# EAGLE design video-cpld (EAGLE 5.11)
DRAWN_BY: Alexios; PROJECT_NAME: CFT Mini-Computer; REVISION: Rev J; SHEET_DESCRIPTION: Bus Connectors; SIMULATION_FILENAME: N/A; URL: http://www.bedroomlan.org/cft

## Sheet 1 of 3
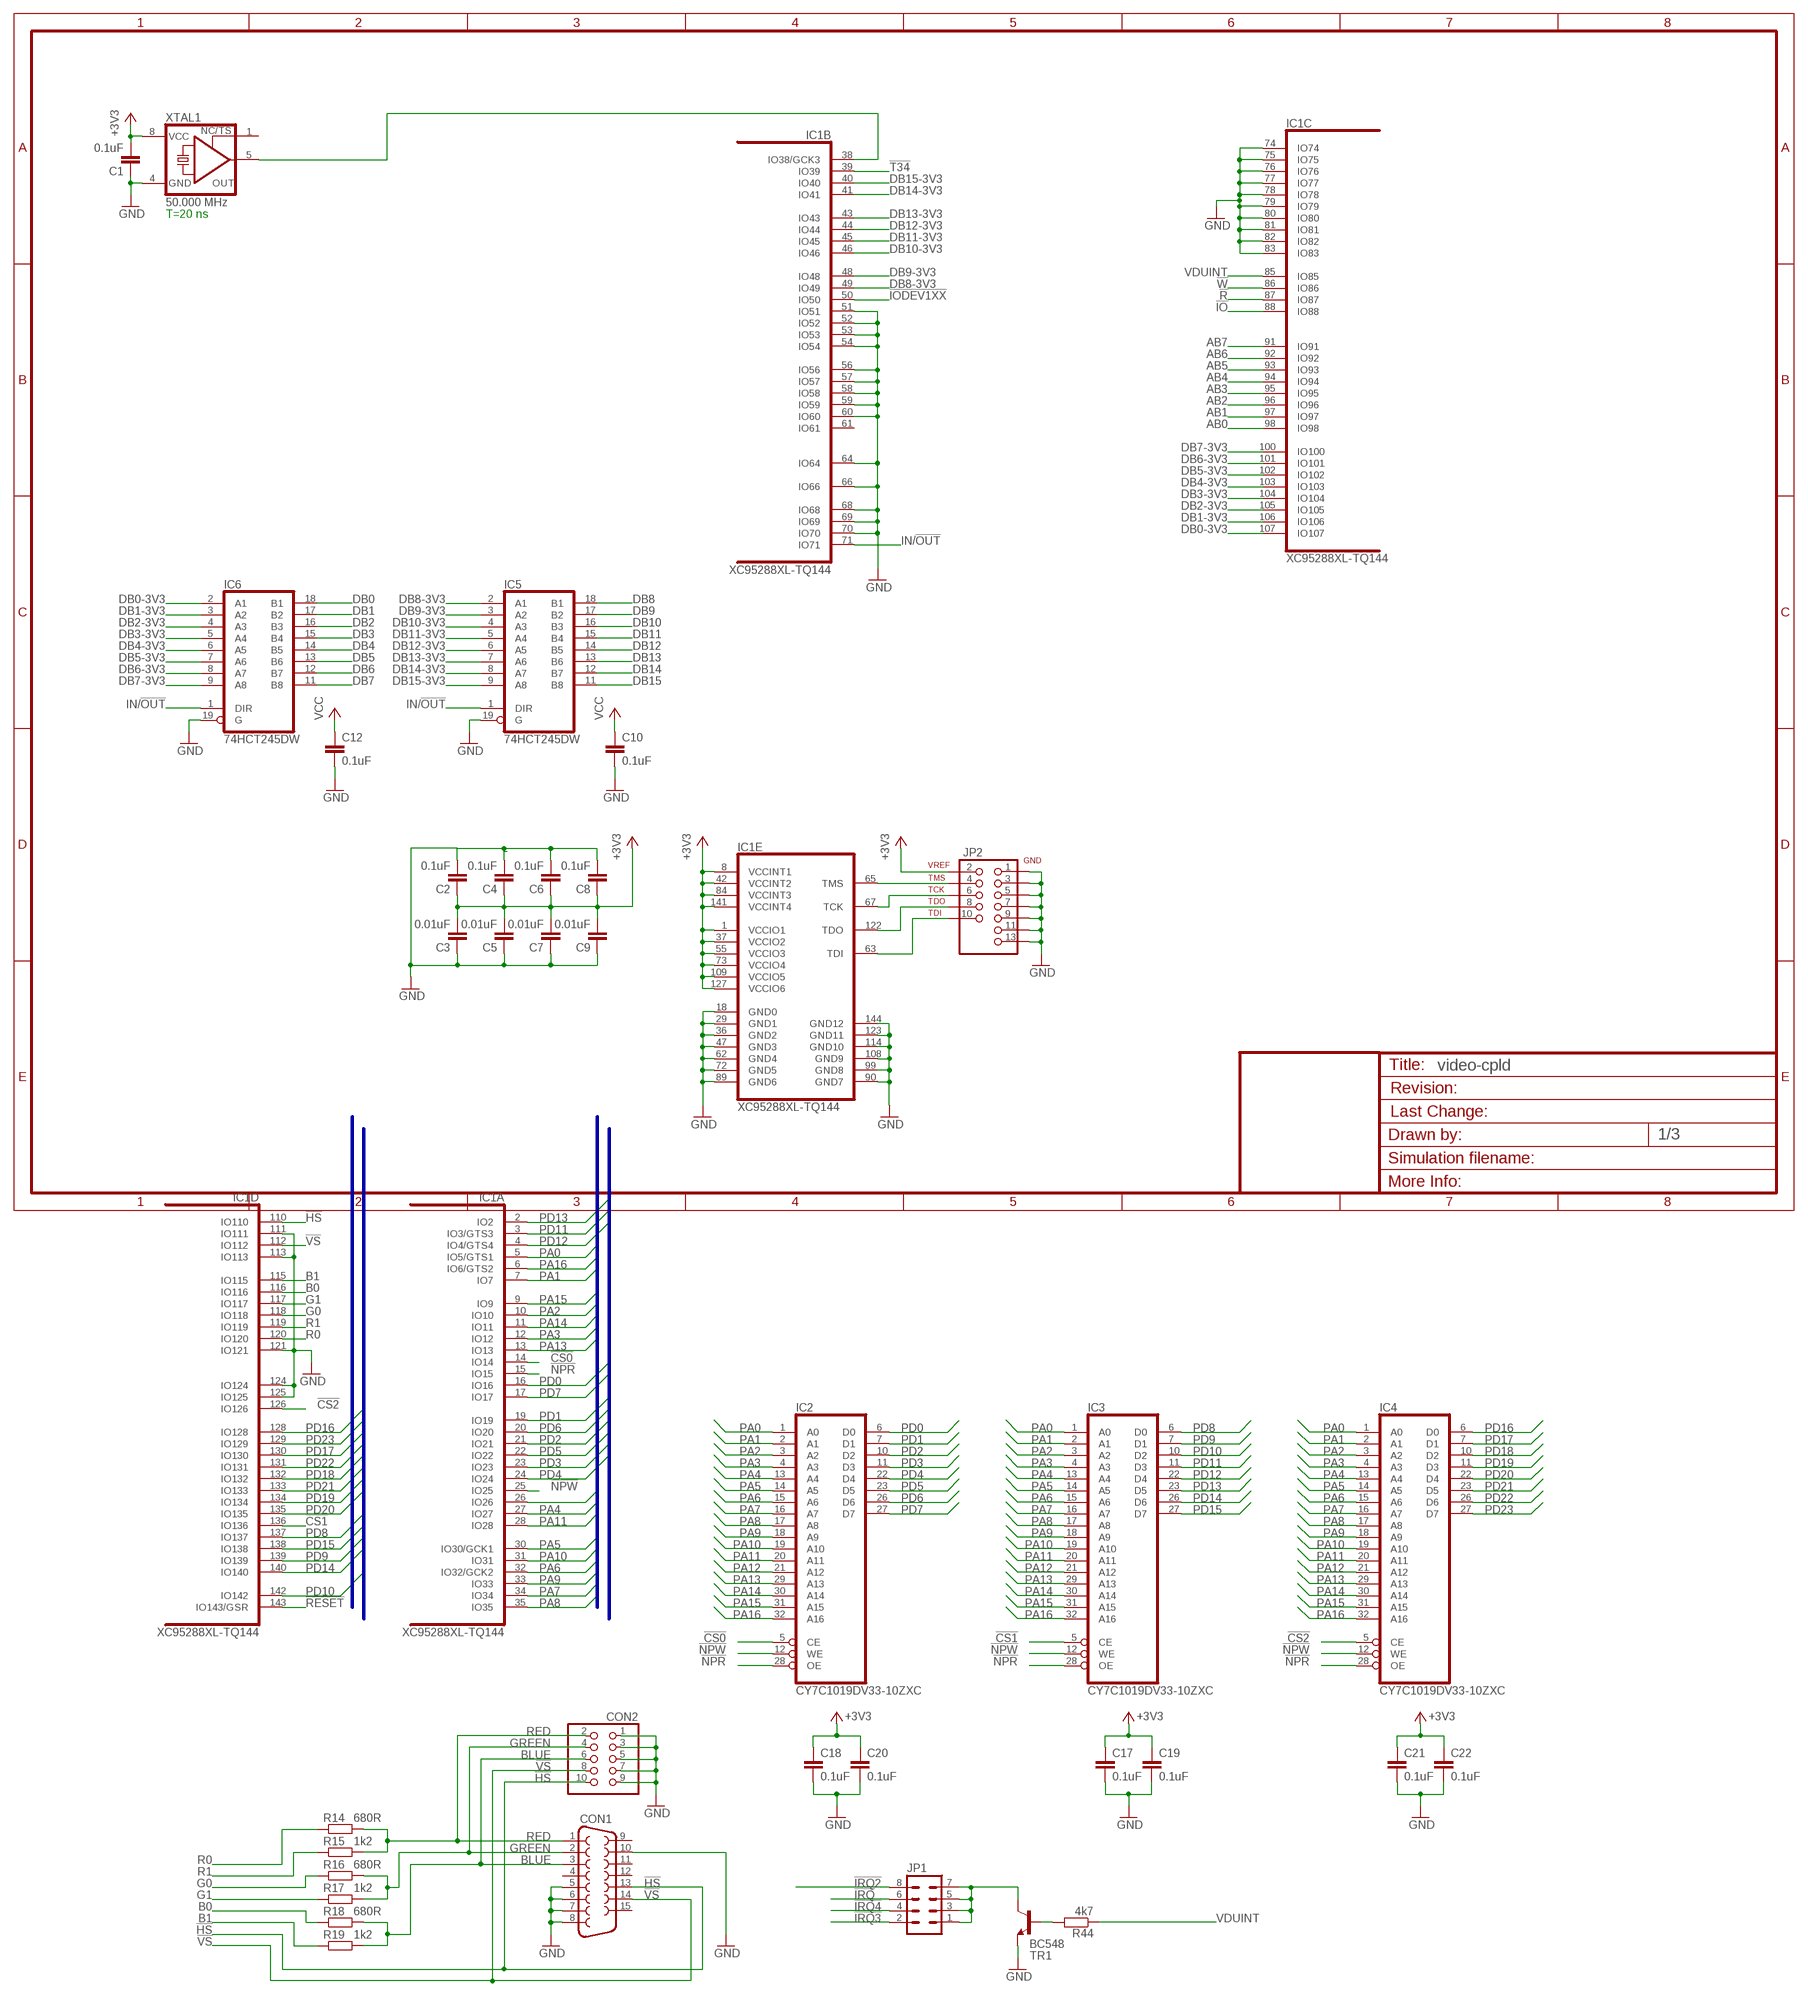
[diagram p0: schematic, sheet 1]

### Parts
C1  0.1uF  C-EUC1206K  [C1206K]
C2  0.1uF  C-EUC1206K  [C1206K]
C3  0.01uF  C-EUC1206K  [C1206K]
C4  0.1uF  C-EUC1206K  [C1206K]
C5  0.01uF  C-EUC1206K  [C1206K]
C6  0.1uF  C-EUC1206K  [C1206K]
C7  0.01uF  C-EUC1206K  [C1206K]
C8  0.1uF  C-EUC1206K  [C1206K]
C9  0.01uF  C-EUC1206K  [C1206K]
C10  0.1uF  C-EUC1206K  [C1206K]
C12  0.1uF  C-EUC1206K  [C1206K]
C17  0.1uF  C-EUC1206K  [C1206K]
C18  0.1uF  C-EUC1206K  [C1206K]
C19  0.1uF  C-EUC1206K  [C1206K]
C20  0.1uF  C-EUC1206K  [C1206K]
C21  0.1uF  C-EUC1206K  [C1206K]
C22  0.1uF  C-EUC1206K  [C1206K]
CON1  F15HDH  [HDF15H]
CON2  PINHD-2X5  [2X05]
IC1  XC95288XL-TQ144  [TQFP144]
IC2  CY7C1019DV33-10ZXC  [TSOPII-32]
IC3  CY7C1019DV33-10ZXC  [TSOPII-32]
IC4  CY7C1019DV33-10ZXC  [TSOPII-32]
IC5  74HCT245DW  [SO20W]
IC6  74HCT245DW  [SO20W]
JP1  MA04-2  [MA04-2]
JP2  JTAG-XILINX-14-2MM  [2X07M]
R14  680R  R-EU_0204/7  [0204/7]
R15  1k2  R-EU_0204/7  [0204/7]
R16  680R  R-EU_0204/7  [0204/7]
R17  1k2  R-EU_0204/7  [0204/7]
R18  680R  R-EU_0204/7  [0204/7]
R19  1k2  R-EU_0204/7  [0204/7]
R44  4k7  R-EU_0204/7  [0204/7]
TR1  BC548  [TO92-EBC]
XTAL1  50.000 MHz  XO-08-SOCKET  [DIL08S-SOCKET]

### Nets
!CS0: IC1.14(A:IO14) IC2.5(CE)
!CS1: IC1.136(D:IO136) IC3.5(CE)
!CS2: IC1.126(D:IO126) IC4.5(CE)
!HS: CON1.13 CON2.10 IC1.110(D:IO110)
!IO: IC1.88(C:IO88) ; also sheet 3
!IODEV1XX: IC1.50(B:IO50) ; also sheet 3
!IRQ: JP1.6 ; also sheet 3
!IRQ2: JP1.8 ; also sheet 3
!IRQ3: JP1.2 ; also sheet 3
!IRQ4: JP1.4 ; also sheet 3
!NPR: IC1.15(A:IO15) IC2.28(OE) IC3.28(OE) IC4.28(OE)
!NPW: IC1.25(A:IO25) IC2.12(WE) IC3.12(WE) IC4.12(WE)
!R: IC1.87(C:IO87) ; also sheet 3
!RESET: IC1.143(D:IO143/GSR) ; also sheet 3
!T34: IC1.39(B:IO39) ; also sheet 3
!VS: CON1.14 CON2.8 IC1.112(D:IO112)
!W: IC1.86(C:IO86) ; also sheet 3
+3V3 [3.3V power]: C1.2 C2.1 C3.2 C4.1 C5.2 C6.1 C7.2 C8.1 C9.2 C17.1 C18.1 C19.1 C20.1 C21.1 C22.1 IC1.1(E:VCCIO1) IC1.8(E:VCCINT1) IC1.37(E:VCCIO2) IC1.42(E:VCCINT2) IC1.55(E:VCCIO3) IC1.73(E:VCCIO4) IC1.84(E:VCCINT3) IC1.109(E:VCCIO5) IC1.127(E:VCCIO6) IC1.141(E:VCCINT4) JP2.2(VREF) XTAL1.8(VCC) ; also sheet 3
AB0: IC1.98(C:IO98) ; also sheet 3
AB1: IC1.97(C:IO97) ; also sheet 3
AB2: IC1.96(C:IO96) ; also sheet 3
AB3: IC1.95(C:IO95) ; also sheet 3
AB4: IC1.94(C:IO94) ; also sheet 3
AB5: IC1.93(C:IO93) ; also sheet 3
AB6: IC1.92(C:IO92) ; also sheet 3
AB7: IC1.91(C:IO91) ; also sheet 3
B0: IC1.116(D:IO116) R18.1
B1: IC1.115(D:IO115) R19.1
BLUE [Analogue]: CON1.3 CON2.6 R18.2 R19.2
DB0: IC6.18(B1) ; also sheet 3
DB0-3V3: IC1.107(C:IO107) IC6.2(A1)
DB1: IC6.17(B2) ; also sheet 3
DB1-3V3: IC1.106(C:IO106) IC6.3(A2)
DB2: IC6.16(B3) ; also sheet 3
DB2-3V3: IC1.105(C:IO105) IC6.4(A3)
DB3: IC6.15(B4) ; also sheet 3
DB3-3V3: IC1.104(C:IO104) IC6.5(A4)
DB4: IC6.14(B5) ; also sheet 3
DB4-3V3: IC1.103(C:IO103) IC6.6(A5)
DB5: IC6.13(B6) ; also sheet 3
DB5-3V3: IC1.102(C:IO102) IC6.7(A6)
DB6: IC6.12(B7) ; also sheet 3
DB6-3V3: IC1.101(C:IO101) IC6.8(A7)
DB7: IC6.11(B8) ; also sheet 3
DB7-3V3: IC1.100(C:IO100) IC6.9(A8)
DB8: IC5.18(B1) ; also sheet 3
DB8-3V3: IC1.49(B:IO49) IC5.2(A1)
DB9: IC5.17(B2) ; also sheet 3
DB9-3V3: IC1.48(B:IO48) IC5.3(A2)
DB10: IC5.16(B3) ; also sheet 3
DB10-3V3: IC1.46(B:IO46) IC5.4(A3)
DB11: IC5.15(B4) ; also sheet 3
DB11-3V3: IC1.45(B:IO45) IC5.5(A4)
DB12: IC5.14(B5) ; also sheet 3
DB12-3V3: IC1.44(B:IO44) IC5.6(A5)
DB13: IC5.13(B6) ; also sheet 3
DB13-3V3: IC1.43(B:IO43) IC5.7(A6)
DB14: IC5.12(B7) ; also sheet 3
DB14-3V3: IC1.41(B:IO41) IC5.8(A7)
DB15: IC5.11(B8) ; also sheet 3
DB15-3V3: IC1.40(B:IO40) IC5.9(A8)
G0: IC1.118(D:IO118) R16.1
G1: IC1.117(D:IO117) R17.1
GND [3.3V power]: C1.1 C2.2 C3.1 C4.2 C5.1 C6.2 C7.1 C8.2 C9.1 C10.2 C12.2 C17.2 C18.2 C19.2 C20.2 C21.2 C22.2 CON1.5 CON1.6 CON1.7 CON1.8 CON1.10 CON2.1 CON2.3 CON2.5 CON2.7 CON2.9 IC1.18(E:GND0) IC1.29(E:GND1) IC1.36(E:GND2) IC1.47(E:GND3) IC1.51(B:IO51) IC1.52(B:IO52) IC1.53(B:IO53) IC1.54(B:IO54) IC1.56(B:IO56) IC1.57(B:IO57) IC1.58(B:IO58) IC1.59(B:IO59) IC1.60(B:IO60) IC1.62(E:GND4) IC1.64(B:IO64) IC1.66(B:IO66) IC1.68(B:IO68) IC1.69(B:IO69) IC1.70(B:IO70) IC1.72(E:GND5) IC1.74(C:IO74) IC1.75(C:IO75) IC1.76(C:IO76) IC1.77(C:IO77) IC1.78(C:IO78) IC1.79(C:IO79) IC1.80(C:IO80) IC1.81(C:IO81) IC1.82(C:IO82) IC1.83(C:IO83) IC1.89(E:GND6) IC1.90(E:GND7) IC1.99(E:GND8) IC1.108(E:GND9) IC1.111(D:IO111) IC1.113(D:IO113) IC1.114(E:GND10) IC1.121(D:IO121) IC1.123(E:GND11) IC1.124(D:IO124) IC1.125(D:IO125) IC1.144(E:GND12) IC5.19(G) IC6.19(G) JP2.1(VGND) JP2.3(GND2) JP2.5(GND3) JP2.7(GND4) JP2.9(GND5) JP2.11(GND6) JP2.13(GND7) TR1.E XTAL1.4(GND) ; also sheet 3
GREEN [Analogue]: CON1.2 CON2.4 R16.2 R17.2
IN/!OUT: IC1.71(B:IO71) IC5.1(DIR) IC6.1(DIR)
N$1: IC1.38(B:IO38/GCK3) XTAL1.5(OUT)
N$260: JP1.1 JP1.3 JP1.5 JP1.7 TR1.C
N$843: R44.2 TR1.B
PA0: IC1.5(A:IO5/GTS1) IC2.1(A0) IC3.1(A0) IC4.1(A0) ; also sheet 2
PA1: IC1.7(A:IO7) IC2.2(A1) IC3.2(A1) IC4.2(A1) ; also sheet 2
PA2: IC1.10(A:IO10) IC2.3(A2) IC3.3(A2) IC4.3(A2) ; also sheet 2
PA3: IC1.12(A:IO12) IC2.4(A3) IC3.4(A3) IC4.4(A3) ; also sheet 2
PA4: IC1.27(A:IO27) IC2.13(A4) IC3.13(A4) IC4.13(A4) ; also sheet 2
PA5: IC1.30(A:IO30/GCK1) IC2.14(A5) IC3.14(A5) IC4.14(A5) ; also sheet 2
PA6: IC1.32(A:IO32/GCK2) IC2.15(A6) IC3.15(A6) IC4.15(A6) ; also sheet 2
PA7: IC1.34(A:IO34) IC2.16(A7) IC3.16(A7) IC4.16(A7) ; also sheet 2
PA8: IC1.35(A:IO35) IC2.17(A8) IC3.17(A8) IC4.17(A8) ; also sheet 2
PA9: IC1.33(A:IO33) IC2.18(A9) IC3.18(A9) IC4.18(A9) ; also sheet 2
PA10: IC1.31(A:IO31) IC2.19(A10) IC3.19(A10) IC4.19(A10) ; also sheet 2
PA11: IC1.28(A:IO28) IC2.20(A11) IC3.20(A11) IC4.20(A11) ; also sheet 2
PA12: IC1.26(A:IO26) IC2.21(A12) IC3.21(A12) IC4.21(A12) ; also sheet 2
PA13: IC1.13(A:IO13) IC2.29(A13) IC3.29(A13) IC4.29(A13) ; also sheet 2
PA14: IC1.11(A:IO11) IC2.30(A14) IC3.30(A14) IC4.30(A14) ; also sheet 2
PA15: IC1.9(A:IO9) IC2.31(A15) IC3.31(A15) IC4.31(A15)
PA16: IC1.6(A:IO6/GTS2) IC2.32(A16) IC3.32(A16) IC4.32(A16)
PD0: IC1.16(A:IO16) IC2.6(D0) ; also sheet 2
PD1: IC1.19(A:IO19) IC2.7(D1) ; also sheet 2
PD2: IC1.21(A:IO21) IC2.10(D2) ; also sheet 2
PD3: IC1.23(A:IO23) IC2.11(D3) ; also sheet 2
PD4: IC1.24(A:IO24) IC2.22(D4) ; also sheet 2
PD5: IC1.22(A:IO22) IC2.23(D5) ; also sheet 2
PD6: IC1.20(A:IO20) IC2.26(D6) ; also sheet 2
PD7: IC1.17(A:IO17) IC2.27(D7) ; also sheet 2
PD8: IC1.137(D:IO137) IC3.6(D0) ; also sheet 2
PD9: IC1.139(D:IO139) IC3.7(D1) ; also sheet 2
PD10: IC1.142(D:IO142) IC3.10(D2) ; also sheet 2
PD11: IC1.3(A:IO3/GTS3) IC3.11(D3) ; also sheet 2
PD12: IC1.4(A:IO4/GTS4) IC3.22(D4) ; also sheet 2
PD13: IC1.2(A:IO2) IC3.23(D5) ; also sheet 2
PD14: IC1.140(D:IO140) IC3.26(D6) ; also sheet 2
PD15: IC1.138(D:IO138) IC3.27(D7) ; also sheet 2
PD16: IC1.128(D:IO128) IC4.6(D0) ; also sheet 2
PD17: IC1.130(D:IO130) IC4.7(D1) ; also sheet 2
PD18: IC1.132(D:IO132) IC4.10(D2) ; also sheet 2
PD19: IC1.134(D:IO134) IC4.11(D3) ; also sheet 2
PD20: IC1.135(D:IO135) IC4.22(D4) ; also sheet 2
PD21: IC1.133(D:IO133) IC4.23(D5) ; also sheet 2
PD22: IC1.131(D:IO131) IC4.26(D6) ; also sheet 2
PD23: IC1.129(D:IO129) IC4.27(D7) ; also sheet 2
R0: IC1.120(D:IO120) R14.1
R1: IC1.119(D:IO119) R15.1
RED [Analogue]: CON1.1 CON2.2 R14.2 R15.2
TCK: IC1.67(E:TCK) JP2.6(TCK)
TDI: IC1.63(E:TDI) JP2.10(TDI)
TDO: IC1.122(E:TDO) JP2.8(TDO)
TMS: IC1.65(E:TMS) JP2.4(TMS)
VCC: C10.1 C12.1 ; also sheet 3
VDUINT: IC1.85(C:IO85) R44.1
Unconnected: CON1.4 CON1.9 CON1.11 CON1.12 CON1.15 IC1.61(B:IO61) XTAL1.1(TS)

### Buses
PA[0..16]
PD[0..23]

### Notes on the sheet
- T=20 ns

## Sheet 2 of 3
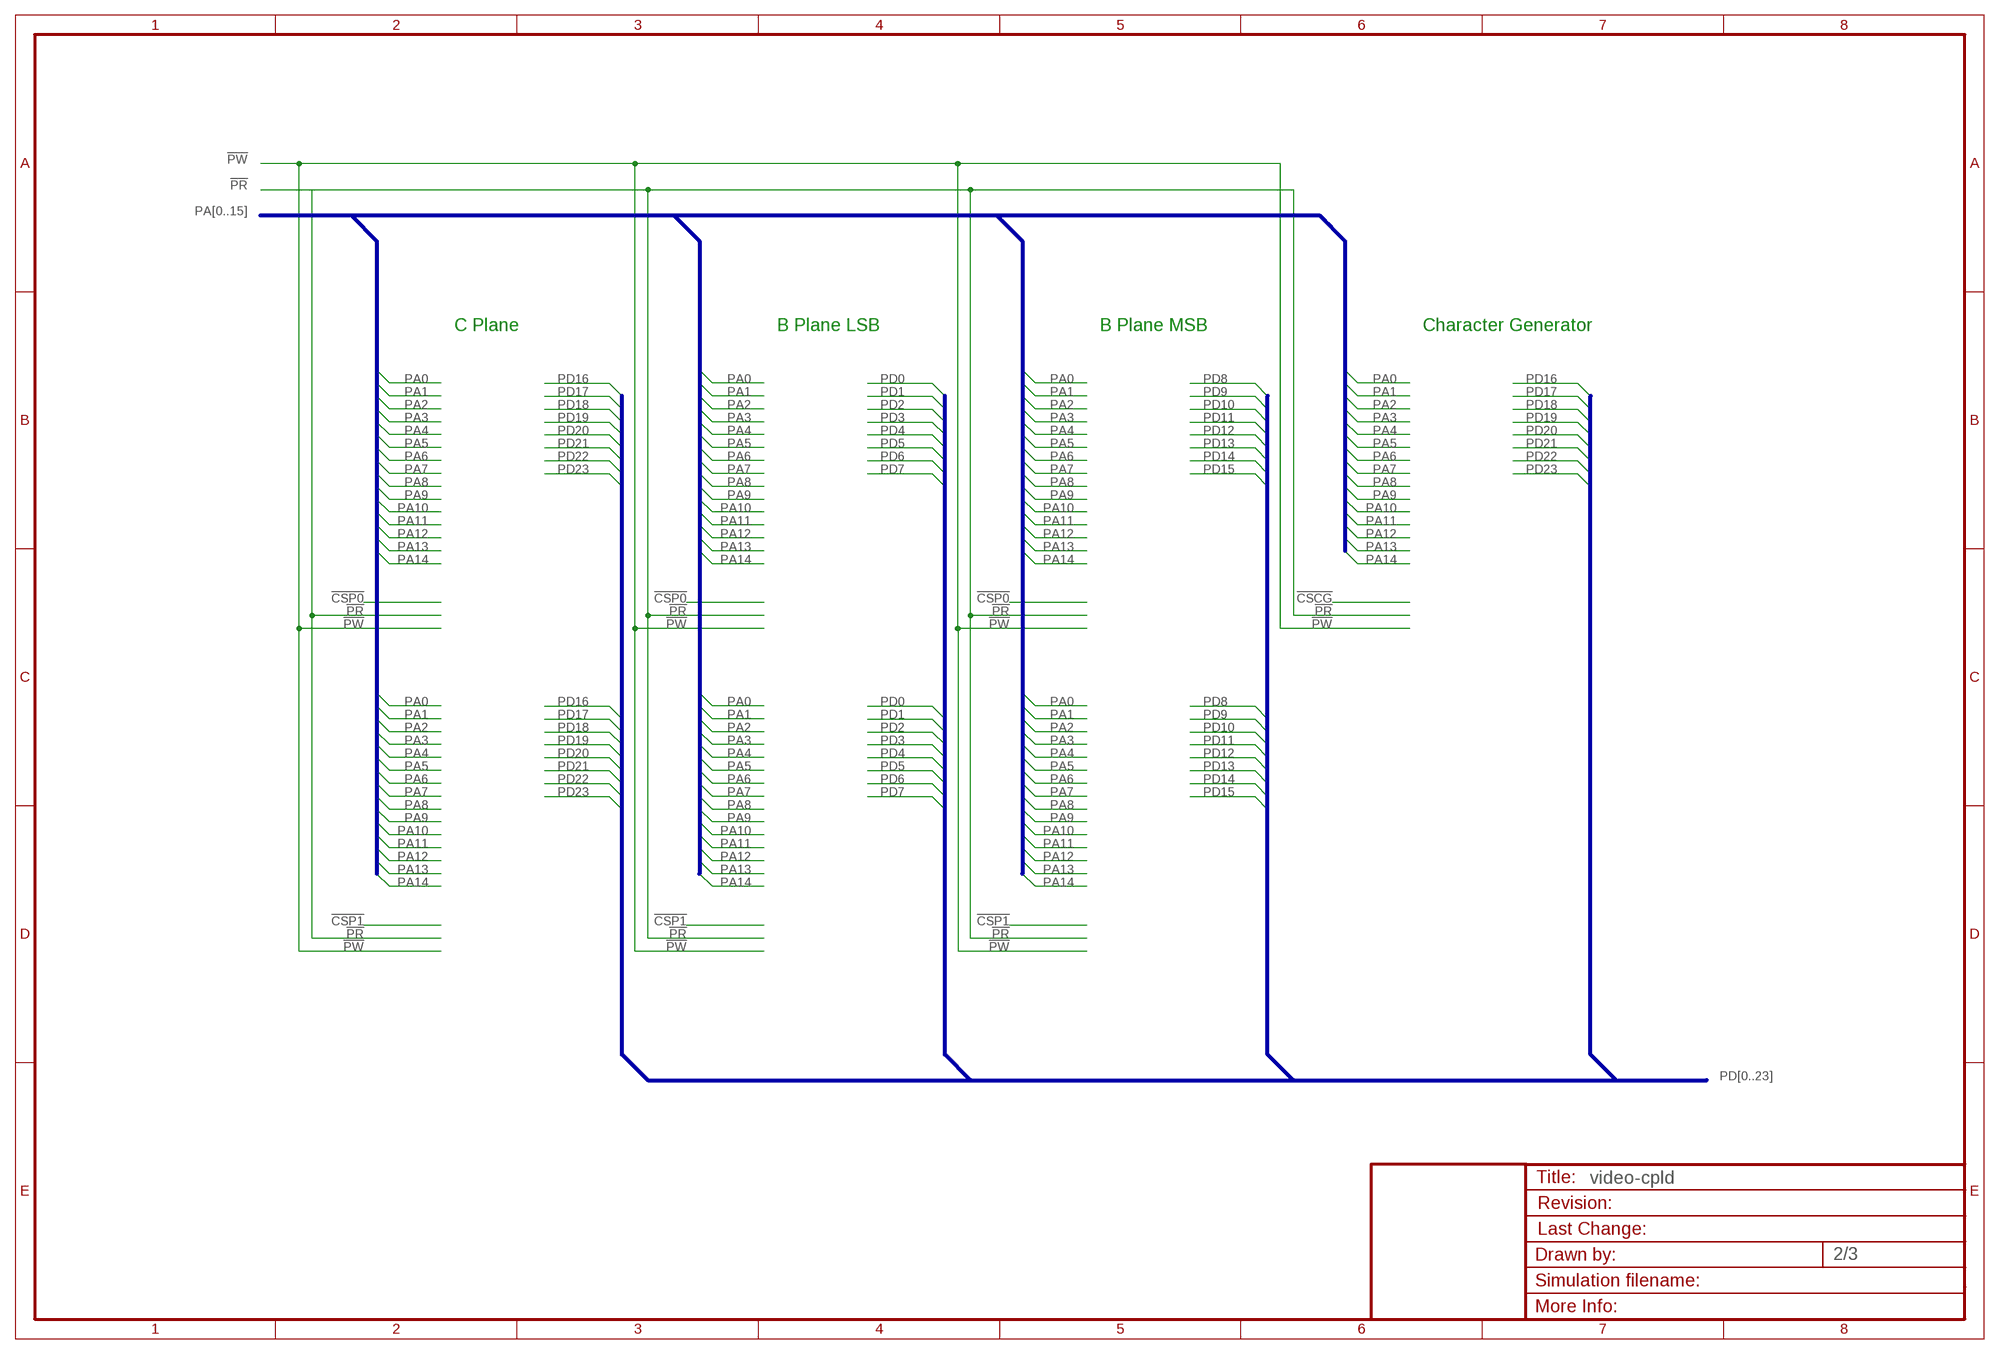
[diagram p1: schematic, sheet 2]

### Buses
PA[0..15]
CD[0..15]
PD[0..15]
PD[0..23]
CD[0..23]

### Notes on the sheet
- C Plane | B Plane LSB | B Plane MSB | Character Generator

## Sheet 3 of 3
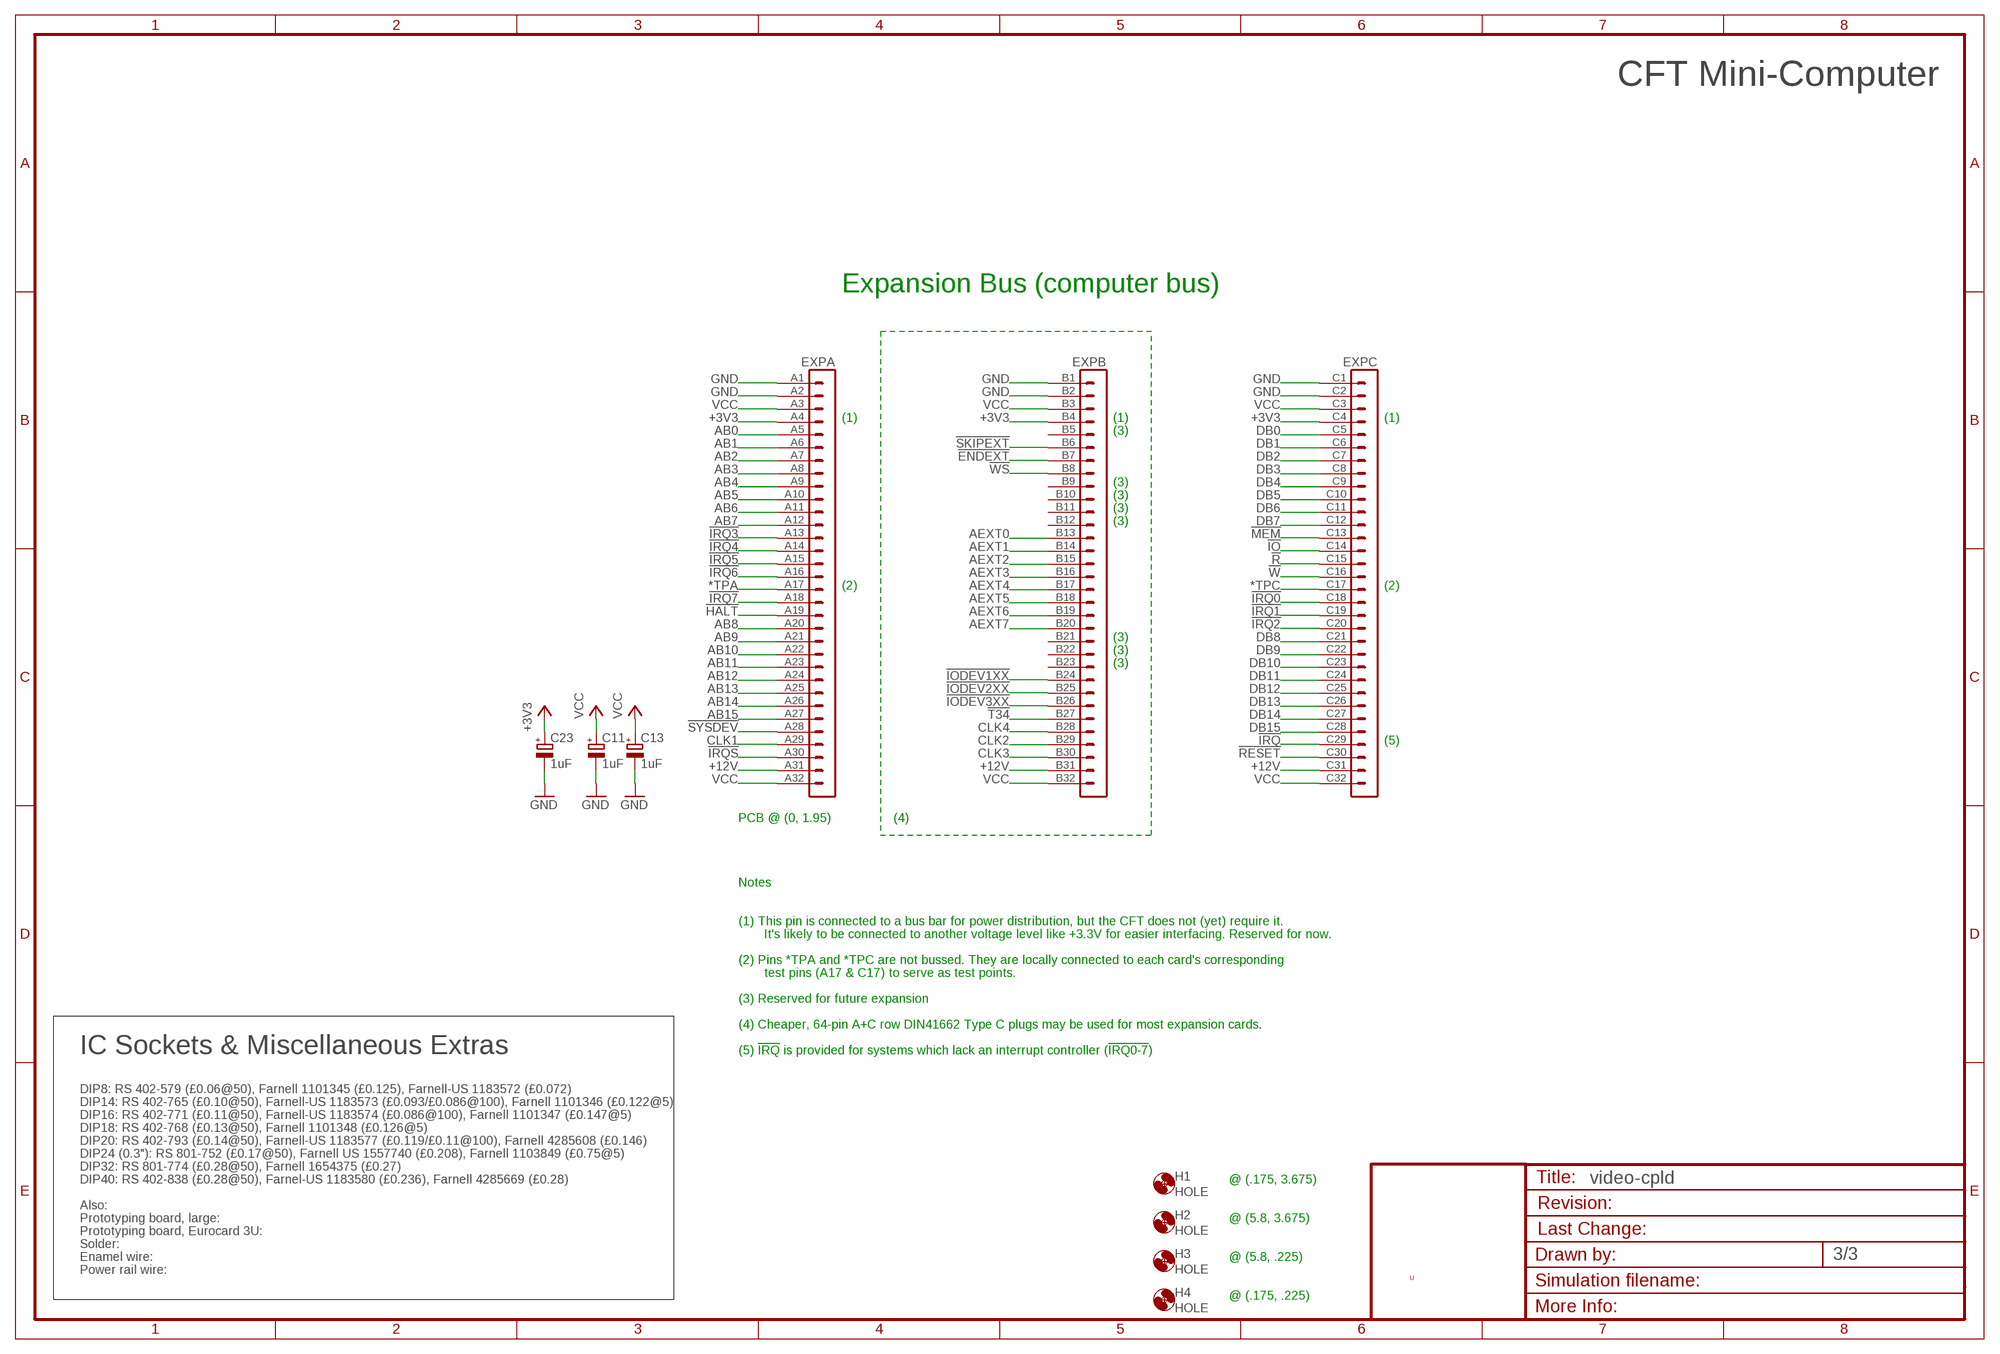
[diagram p2: schematic, sheet 3]

### Parts
C11  1uF  CPOL-EUE2.5-5  [E2,5-5]
C13  1uF  CPOL-EUE2.5-5  [E2,5-5]
C23  1uF  CPOL-EUE2.5-5  [E2,5-5]
EXP  VG96-3K  [VG96K]
H1  HOLE  [STANDOFF_28_60]
H2  HOLE  [STANDOFF_28_60]
H3  HOLE  [STANDOFF_28_60]
H4  HOLE  [STANDOFF_28_60]

### Nets
!ENDEXT: EXP.B7
!HALT: EXP.A19
!IO: EXP.C14 ; also sheet 1
!IODEV1XX: EXP.B24 ; also sheet 1
!IODEV2XX: EXP.B25
!IODEV3XX: EXP.B26
!IRQ: EXP.C29 ; also sheet 1
!IRQ0: EXP.C18
!IRQ1: EXP.C19
!IRQ2: EXP.C20 ; also sheet 1
!IRQ3: EXP.A13 ; also sheet 1
!IRQ4: EXP.A14 ; also sheet 1
!IRQ5: EXP.A15
!IRQ6: EXP.A16
!IRQ7: EXP.A18
!IRQS: EXP.A30
!MEM: EXP.C13
!R: EXP.C15 ; also sheet 1
!RESET: EXP.C30 ; also sheet 1
!SKIPEXT: EXP.B6
!SYSDEV: EXP.A28
!T34: EXP.B27 ; also sheet 1
!W: EXP.C16 ; also sheet 1
!WS: EXP.B8
*TPA: EXP.A17
*TPC: EXP.C17
+3V3 [3.3V power]: C23.+ EXP.A4 EXP.B4 EXP.C4 ; also sheet 1
+12V [LED power]: EXP.A31 EXP.B31 EXP.C31
AB0: EXP.A5 ; also sheet 1
AB1: EXP.A6 ; also sheet 1
AB2: EXP.A7 ; also sheet 1
AB3: EXP.A8 ; also sheet 1
AB4: EXP.A9 ; also sheet 1
AB5: EXP.A10 ; also sheet 1
AB6: EXP.A11 ; also sheet 1
AB7: EXP.A12 ; also sheet 1
AB8: EXP.A20
AB9: EXP.A21
AB10: EXP.A22
AB11: EXP.A23
AB12: EXP.A24
AB13: EXP.A25
AB14: EXP.A26
AB15: EXP.A27
AEXT0: EXP.B13
AEXT1: EXP.B14
AEXT2: EXP.B15
AEXT3: EXP.B16
AEXT4: EXP.B17
AEXT5: EXP.B18
AEXT6: EXP.B19
AEXT7: EXP.B20
CLK1: EXP.A29
CLK2: EXP.B29
CLK3: EXP.B30
CLK4: EXP.B28
DB0: EXP.C5 ; also sheet 1
DB1: EXP.C6 ; also sheet 1
DB2: EXP.C7 ; also sheet 1
DB3: EXP.C8 ; also sheet 1
DB4: EXP.C9 ; also sheet 1
DB5: EXP.C10 ; also sheet 1
DB6: EXP.C11 ; also sheet 1
DB7: EXP.C12 ; also sheet 1
DB8: EXP.C21 ; also sheet 1
DB9: EXP.C22 ; also sheet 1
DB10: EXP.C23 ; also sheet 1
DB11: EXP.C24 ; also sheet 1
DB12: EXP.C25 ; also sheet 1
DB13: EXP.C26 ; also sheet 1
DB14: EXP.C27 ; also sheet 1
DB15: EXP.C28 ; also sheet 1
GND [3.3V power]: C11.- C13.- C23.- EXP.A1 EXP.A2 EXP.B1 EXP.B2 EXP.C1 EXP.C2 ; also sheet 1
VCC: C11.+ C13.+ EXP.A3 EXP.A32 EXP.B3 EXP.B32 EXP.C3 EXP.C32 ; also sheet 1
Unconnected: EXP.B5 EXP.B9 EXP.B10 EXP.B11 EXP.B12 EXP.B21 EXP.B22 EXP.B23

### Notes on the sheet
- CFT Mini-Computer
- Expansion Bus (computer bus)
- (1) | (1) | (1)
- (3)
- (3)
- (3)
- (3)
- (3)
- (2) | (2)
- (3)
- (3)
- (3)
- (5)
- PCB @ (0, 1.95) | (4)
- Notes
- (1) This pin is connected to a bus bar for power distribution, but the CFT does not (yet) require it.
- It's likely to be connected to another voltage level like +3.3V for easier interfacing. Reserved for now.
- (2) Pins *TPA and *TPC are not bussed. They are locally connected to each card's corresponding
- test pins (A17 & C17) to serve as test points.
- (3) Reserved for future expansion
- (4) Cheaper, 64-pin A+C row DIN41662 Type C plugs may be used for most expansion cards.
- IC Sockets & Miscellaneous Extras | (5) !IRQ! is provided for systems which lack an interrupt controller (!IRQ0-7!)
- DIP8: RS 402-579 (£0.06@50), Farnell 1101345 (£0.125), Farnell-US 1183572 (£0.072)
- DIP14: RS 402-765 (£0.10@50), Farnell-US 1183573 (£0.093/£0.086@100), Farnell 1101346 (£0.122@5)
- DIP16: RS 402-771 (£0.11@50), Farnell-US 1183574 (£0.086@100), Farnell 1101347 (£0.147@5)
- DIP18: RS 402-768 (£0.13@50), Farnell 1101348 (£0.126@5)
- DIP20: RS 402-793 (£0.14@50), Farnell-US 1183577 (£0.119/£0.11@100), Farnell 4285608 (£0.146)
- DIP24 (0.3"): RS 801-752 (£0.17@50), Farnell US 1557740 (£0.208), Farnell 1103849 (£0.75@5)
- DIP32: RS 801-774 (£0.28@50), Farnell 1654375 (£0.27)
- DIP40: RS 402-838 (£0.28@50), Farnel-US 1183580 (£0.236), Farnell 4285669 (£0.28) | @ (.175, 3.675)
- Also:
- Prototyping board, large: | @ (5.8, 3.675)
- Prototyping board, Eurocard 3U:
- Solder:
- Enamel wire: | @ (5.8, .225)
- Power rail wire:
- U
- @ (.175, .225)

## Power pins joined to a net without a drawn wire
+3V3: IC2.8(+3V3) IC2.24(+3V3) IC3.8(+3V3) IC3.24(+3V3) IC4.8(+3V3) IC4.24(+3V3)
GND: IC2.9(GND) IC2.25(GND) IC3.9(GND) IC3.25(GND) IC4.9(GND) IC4.25(GND) IC5.10(GND) IC6.10(GND)
VCC: IC5.20(VCC) IC6.20(VCC)

## Library data of the parts
C1-C10 C12 C17-C22 = rcl:C-EU: CAPACITOR, European symbol
C11 C13 C23 = rcl:CPOL-EU: POLARIZED CAPACITOR, European symbol
CON1 = con-subd:F15: SUB-D; OC_FARNELL: unknown; OC_NEWARK: unknown
CON2 = pinhead:PINHD-2X5: PIN HEADER
EXP = alexios-19inch:VG96-3: PCB EUROCARD, 96-pin type C/ABC, 2.54 mm
H1-H4 = alexios:HOLE: Hole for a standoff or mount. Hole diameter: 3.3mm. External Diameter: 6mm.
IC1 = alexios:XC95288XL: Xilinx 288 Macrocell, 144-pin CPLD
IC2-IC4 = alexios:CY7C1019DV33: 128K x 8 Static RAM 10ns Source: Cypress CYP05780611.pdf
IC5 IC6 = alexios:74*245: Octal BUS TRANSCEIVER, 3-state
JP1 = con-lstb:MA04-2: PIN HEADER; OC_FARNELL: unknown; OC_NEWARK: unknown
JP2 = alexios:JTAG: Xilinx JTAG implemented as a 2×14-pin 2mm pitch through-hole header.
R14-R19 R44 = rcl:R-EU_: RESISTOR, European symbol
TR1 = transistor-npn:BC548*: NPN Transistor
XTAL1 = alexios:XO-: Crystal Oscillator for DIP sockets Crystal oscillators in DIP8 or DIP14 packages with sockets. Drills extra holes on the PCB to allow a standard DIP8 or DIP14 socket to be installed.

## Net classes
0 default: width 0.254 mm, clearance 0.203 mm
1 low power: width 1.27 mm, clearance 0.254 mm
2 LED power: width 1.93 mm, clearance 0.254 mm
3 3.3V power: width 0.61 mm, clearance 0.203 mm
4 Analogue: width 0.406 mm, clearance 0.305 mm

## Board
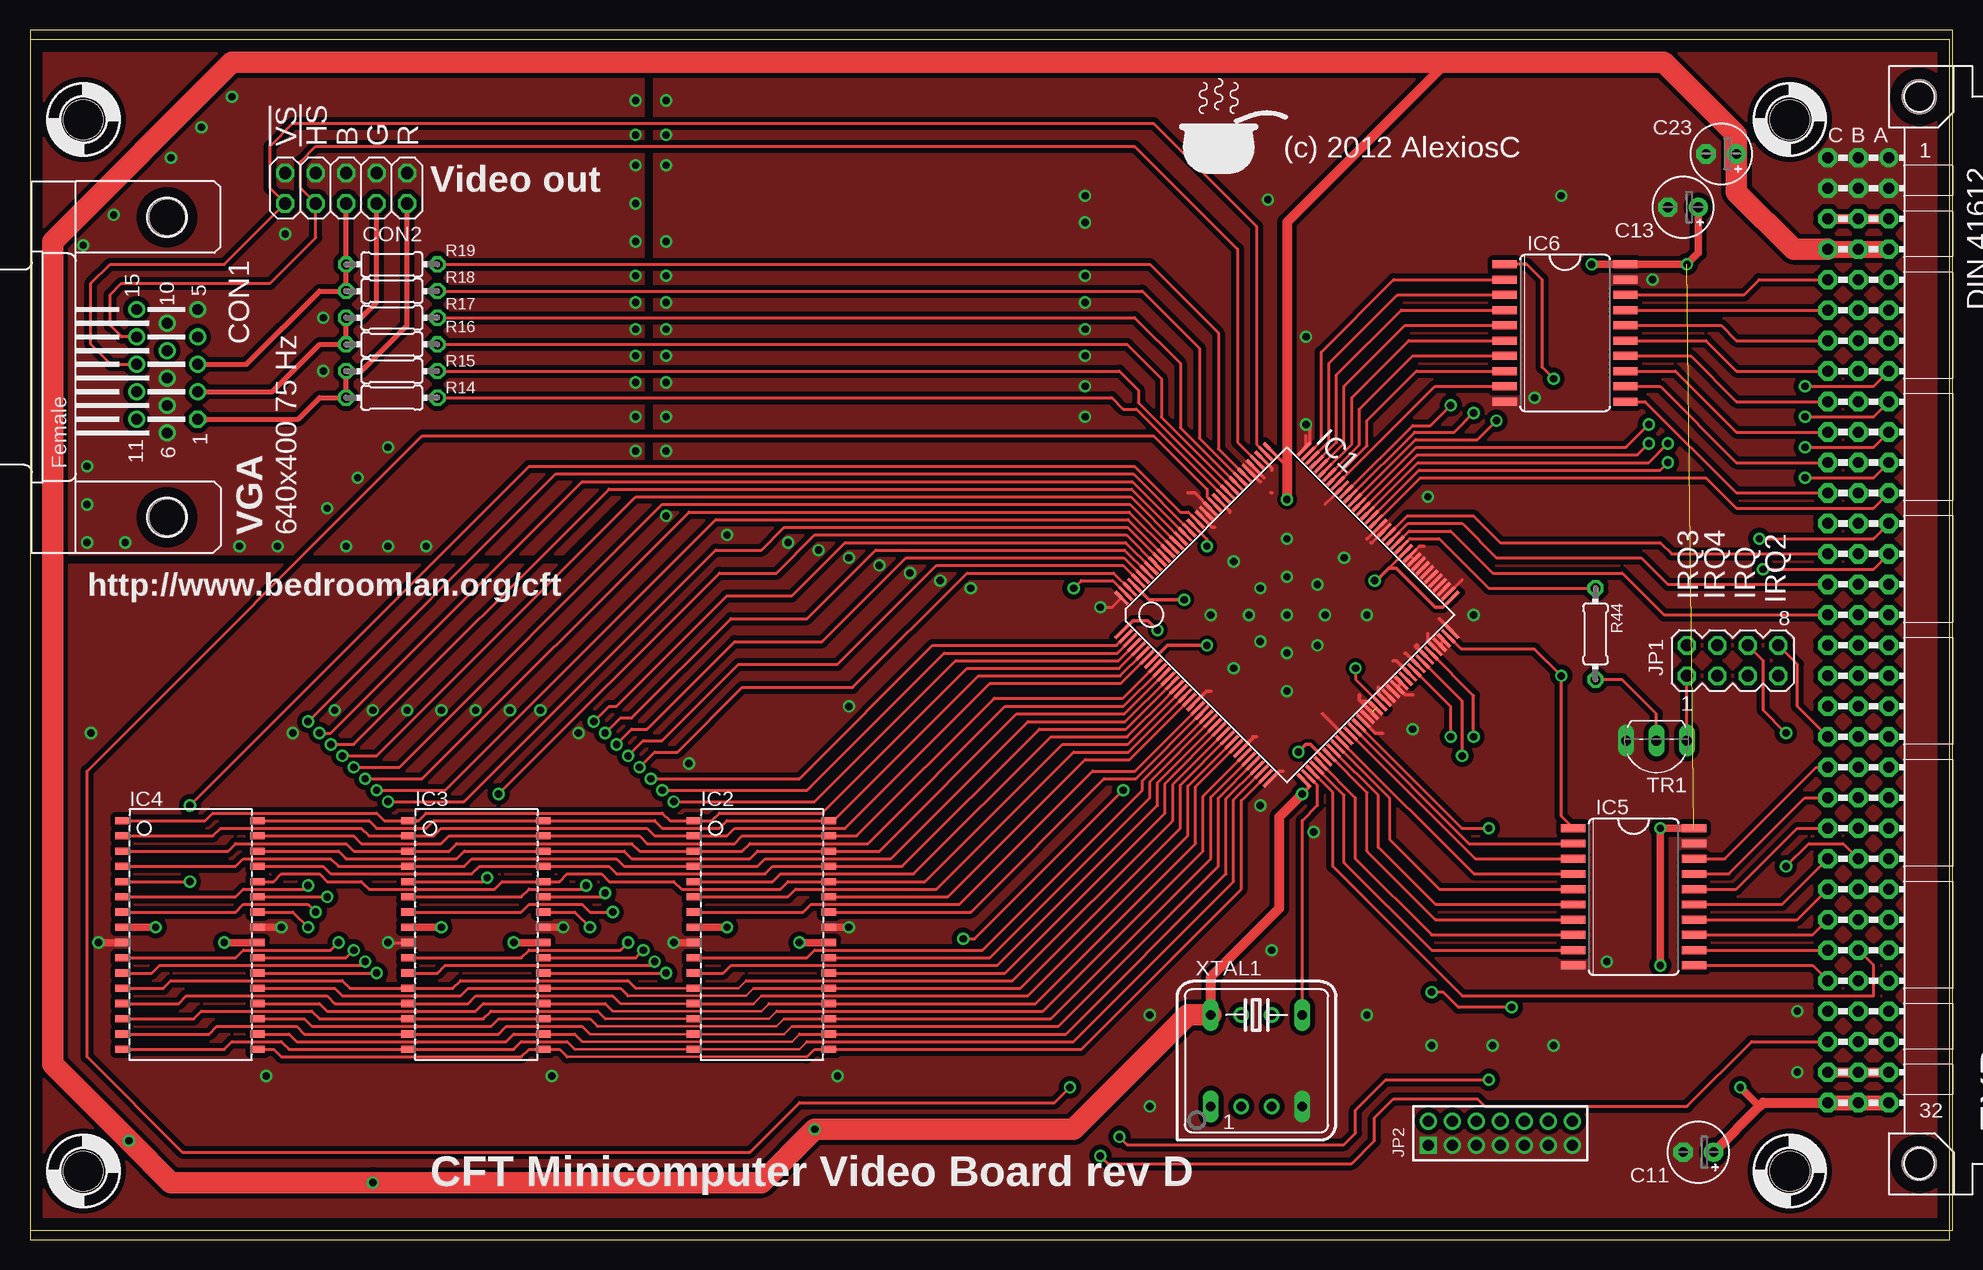
[diagram p3: board, top side]
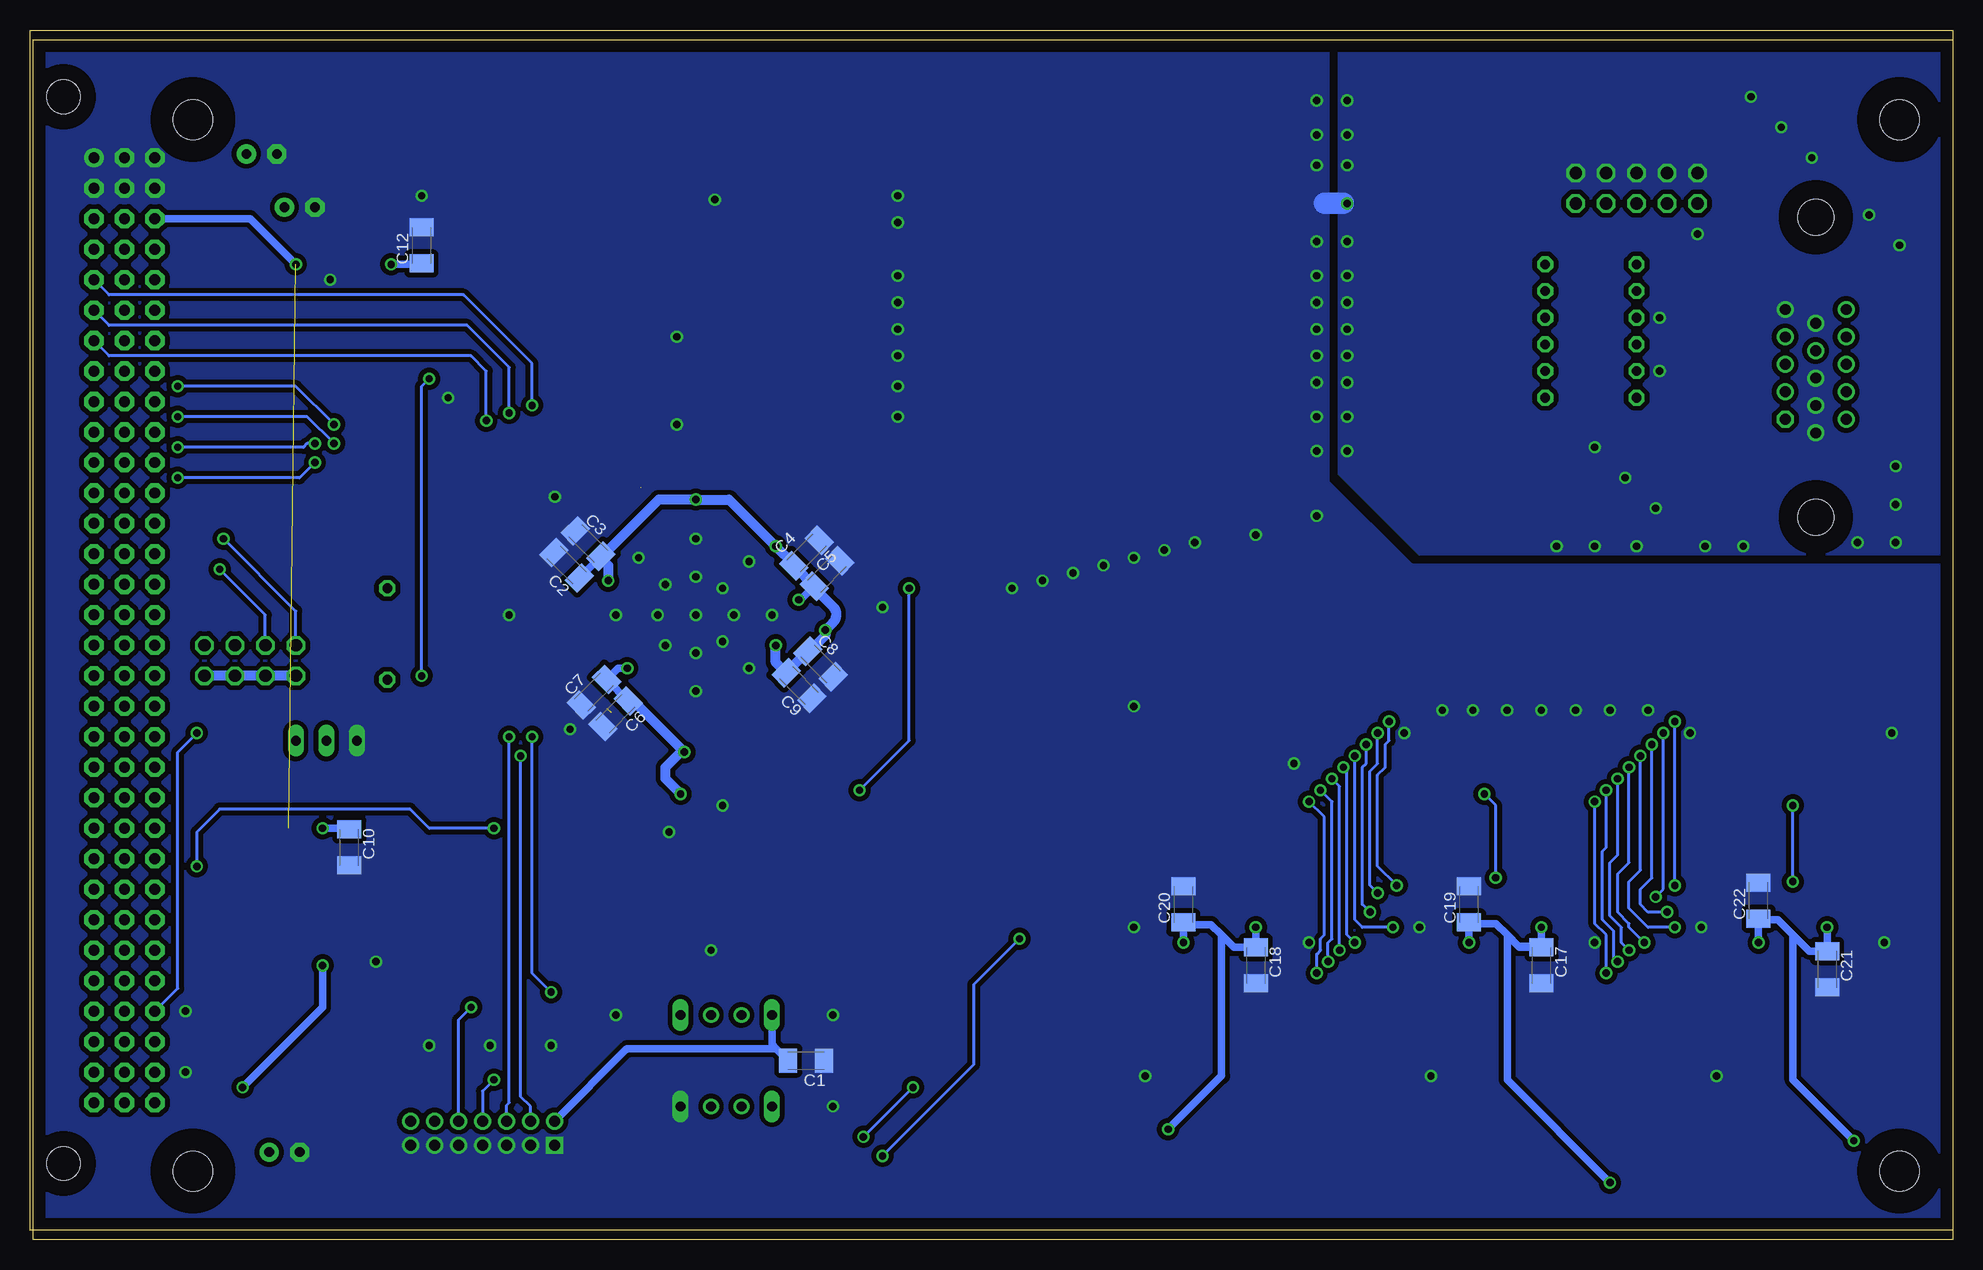
[diagram p4: board, bottom side, seen from below]

Size 160 x 100 mm. Coordinates in mm from the lower left corner, seen from the top.
Outline: 0,0 160,0 160,100 0,100 0,0
Copper layers (1*16): Top 0.035mm / dielectric 1.5mm / Bottom 0.035mm
Design rules "olimex-10mil *": minimum track width 10mil, minimum drill 24mil, track to track 7mil, track to pad 7mil, pad to pad 7mil, via to via 7mil, smd to smd 7mil, copper to edge 40mil, drill to drill 10mil, minimum pad ring 10mil, minimum via ring 8mil, stop-mask expansion 0mil, vias tented up to drill 0mil, thermal gap 10mil

### Footprints (pad centres in the part's own frame; a part is rotated, then mirrored left to right if it is on the bottom)
C1206K = smd 1.5 x 2: 1 -1.5,0; 2 1.5,0
E2,5-5 = drill 0.813 pad 1.6 round: + -1.27,0 | drill 0.813 pad 1.6 octagon: - 1.27,0
HDF15H = drill 0.9 octagon: 1 4.329,2.54 | drill 0.9 round: 2 2.043,2.54; 3 -0.243,2.54; 4 -2.529,2.54; 5 -4.815,2.54; 6 5.472,0; 7 3.186,0; 8 0.9,0; 9 -1.386,0; 10 -3.672,0; 11 4.329,-2.54; 12 2.043,-2.54; 13 -0.243,-2.54; 14 -2.529,-2.54; 15 -4.815,-2.54 | hole 3: -12.5,0; 12.5,0
2X05 = drill 1.016 octagon: 1 -5.08,-1.27; 2 -5.08,1.27; 3 -2.54,-1.27; 4 -2.54,1.27; 5 0,-1.27; 6 0,1.27; 7 2.54,-1.27; 8 2.54,1.27; 9 5.08,-1.27; 10 5.08,1.27
VG96K = drill 0.914 pad 1.6 round: A1 154.94,39.37 | drill 0.914 pad 1.6 octagon: A2 154.94,36.83; A3 154.94,34.29; A4 154.94,31.75; A5 154.94,29.21; A6 154.94,26.67; A7 154.94,24.13; A8 154.94,21.59; A9 154.94,19.05; A10 154.94,16.51; A11 154.94,13.97; A12 154.94,11.43; A13 154.94,8.89; A14 154.94,6.35; A15 154.94,3.81; A16 154.94,1.27; A17 154.94,-1.27; A18 154.94,-3.81; A19 154.94,-6.35; A20 154.94,-8.89; A21 154.94,-11.43; A22 154.94,-13.97; A23 154.94,-16.51; A24 154.94,-19.05; A25 154.94,-21.59; A26 154.94,-24.13; A27 154.94,-26.67; A28 154.94,-29.21; A29 154.94,-31.75; A30 154.94,-34.29; A31 154.94,-36.83; A32 154.94,-39.37; B1 152.4,39.37; B2 152.4,36.83; B3 152.4,34.29; B4 152.4,31.75; B5 152.4,29.21; B6 152.4,26.67; B7 152.4,24.13; B8 152.4,21.59; B9 152.4,19.05; B10 152.4,16.51; B11 152.4,13.97; B12 152.4,11.43; B13 152.4,8.89; B14 152.4,6.35; B15 152.4,3.81; B16 152.4,1.27; B17 152.4,-1.27; B18 152.4,-3.81; B19 152.4,-6.35; B20 152.4,-8.89; B21 152.4,-11.43; B22 152.4,-13.97; B23 152.4,-16.51; B24 152.4,-19.05; B25 152.4,-21.59; B26 152.4,-24.13; B27 152.4,-26.67; B28 152.4,-29.21; B29 152.4,-31.75; B30 152.4,-34.29; B31 152.4,-36.83; B32 152.4,-39.37; C1 149.86,39.37; C2 149.86,36.83; C3 149.86,34.29; C4 149.86,31.75; C5 149.86,29.21; C6 149.86,26.67; C7 149.86,24.13; C8 149.86,21.59; C9 149.86,19.05; C10 149.86,16.51; C11 149.86,13.97; C12 149.86,11.43; C13 149.86,8.89; C14 149.86,6.35; C15 149.86,3.81; C16 149.86,1.27; C17 149.86,-1.27; C18 149.86,-3.81; C19 149.86,-6.35; C20 149.86,-8.89; C21 149.86,-11.43; C22 149.86,-13.97; C23 149.86,-16.51; C24 149.86,-19.05; C25 149.86,-21.59; C26 149.86,-24.13; C27 149.86,-26.67; C28 149.86,-29.21; C29 149.86,-31.75; C30 149.86,-34.29; C31 149.86,-36.83; C32 149.86,-39.37 | hole 2.794: 157.48,44.45; 157.48,-44.45
STANDOFF_28_60 = hole 3.302: 0,0
TQFP144 = smd 0.27 x 1.5: 1 -8.75,-10.75; 2 -8.25,-10.75; 3 -7.75,-10.75; 4 -7.25,-10.75; 5 -6.75,-10.75; 6 -6.25,-10.75; 7 -5.75,-10.75; 8 -5.25,-10.75; 9 -4.75,-10.75; 10 -4.25,-10.75; 11 -3.75,-10.75; 12 -3.25,-10.75; 13 -2.75,-10.75; 14 -2.25,-10.75; 15 -1.75,-10.75; 16 -1.25,-10.75; 17 -0.75,-10.75; 18 -0.25,-10.75; 19 0.25,-10.75; 20 0.75,-10.75; 21 1.25,-10.75; 22 1.75,-10.75; 23 2.25,-10.75; 24 2.75,-10.75; 25 3.25,-10.75; 26 3.75,-10.75; 27 4.25,-10.75; 28 4.75,-10.75; 29 5.25,-10.75; 30 5.75,-10.75; 31 6.25,-10.75; 32 6.75,-10.75; 33 7.25,-10.75; 34 7.75,-10.75; 35 8.25,-10.75; 36 8.75,-10.75; 73 8.75,10.75; 74 8.25,10.75; 75 7.75,10.75; 76 7.25,10.75; 77 6.75,10.75; 78 6.25,10.75; 79 5.75,10.75; 80 5.25,10.75; 81 4.75,10.75; 82 4.25,10.75; 83 3.75,10.75; 84 3.25,10.75; 85 2.75,10.75; 86 2.25,10.75; 87 1.75,10.75; 88 1.25,10.75; 89 0.75,10.75; 90 0.25,10.75; 91 -0.25,10.75; 92 -0.75,10.75; 93 -1.25,10.75; 94 -1.75,10.75; 95 -2.25,10.75; 96 -2.75,10.75; 97 -3.25,10.75; 98 -3.75,10.75; 99 -4.25,10.75; 100 -4.75,10.75; 101 -5.25,10.75; 102 -5.75,10.75; 103 -6.25,10.75; 104 -6.75,10.75; 105 -7.25,10.75; 106 -7.75,10.75; 107 -8.25,10.75; 108 -8.75,10.75 | smd 1.5 x 0.27: 37 10.75,-8.75; 38 10.75,-8.25; 39 10.75,-7.75; 40 10.75,-7.25; 41 10.75,-6.75; 42 10.75,-6.25; 43 10.75,-5.75; 44 10.75,-5.25; 45 10.75,-4.75; 46 10.75,-4.25; 47 10.75,-3.75; 48 10.75,-3.25; 49 10.75,-2.75; 50 10.75,-2.25; 51 10.75,-1.75; 52 10.75,-1.25; 53 10.75,-0.75; 54 10.75,-0.25; 55 10.75,0.25; 56 10.75,0.75; 57 10.75,1.25; 58 10.75,1.75; 59 10.75,2.25; 60 10.75,2.75; 61 10.75,3.25; 62 10.75,3.75; 63 10.75,4.25; 64 10.75,4.75; 65 10.75,5.25; 66 10.75,5.75; 67 10.75,6.25; 68 10.75,6.75; 69 10.75,7.25; 70 10.75,7.75; 71 10.75,8.25; 72 10.75,8.75; 109 -10.75,8.75; 110 -10.75,8.25; 111 -10.75,7.75; 112 -10.75,7.25; 113 -10.75,6.75; 114 -10.75,6.25; 115 -10.75,5.75; 116 -10.75,5.25; 117 -10.75,4.75; 118 -10.75,4.25; 119 -10.75,3.75; 120 -10.75,3.25; 121 -10.75,2.75; 122 -10.75,2.25; 123 -10.75,1.75; 124 -10.75,1.25; 125 -10.75,0.75; 126 -10.75,0.25; 127 -10.75,-0.25; 128 -10.75,-0.75; 129 -10.75,-1.25; 130 -10.75,-1.75; 131 -10.75,-2.25; 132 -10.75,-2.75; 133 -10.75,-3.25; 134 -10.75,-3.75; 135 -10.75,-4.25; 136 -10.75,-4.75; 137 -10.75,-5.25; 138 -10.75,-5.75; 139 -10.75,-6.25; 140 -10.75,-6.75; 141 -10.75,-7.25; 142 -10.75,-7.75; 143 -10.75,-8.25; 144 -10.75,-8.75
TSOPII-32 = smd 0.6 x 1.2: 1 -9.525,-5.627; 2 -8.255,-5.627; 3 -6.985,-5.627; 4 -5.715,-5.627; 5 -4.445,-5.627; 6 -3.175,-5.627; 7 -1.905,-5.627; 8 -0.635,-5.627; 9 0.635,-5.627; 10 1.905,-5.627; 11 3.175,-5.627; 12 4.445,-5.627; 13 5.715,-5.627; 14 6.985,-5.627; 15 8.255,-5.627; 16 9.525,-5.627; 17 9.525,5.629; 18 8.255,5.629; 19 6.985,5.629; 20 5.715,5.629; 21 4.445,5.629; 22 3.175,5.629; 23 1.905,5.629; 24 0.635,5.629; 25 -0.635,5.629; 26 -1.905,5.629; 27 -3.175,5.629; 28 -4.445,5.629; 29 -5.715,5.629; 30 -6.985,5.629; 31 -8.255,5.629; 32 -9.525,5.629
SO20W = smd 0.66 x 2.032: 1 -5.715,-5.029; 2 -4.445,-5.029; 3 -3.175,-5.029; 4 -1.905,-5.029; 5 -0.635,-5.029; 6 0.635,-5.029; 7 1.905,-5.029; 8 3.175,-5.029; 9 4.445,-5.029; 10 5.715,-5.029; 11 5.715,5.029; 12 4.445,5.029; 13 3.175,5.029; 14 1.905,5.029; 15 0.635,5.029; 16 -0.635,5.029; 17 -1.905,5.029; 18 -3.175,5.029; 19 -4.445,5.029; 20 -5.715,5.029
MA04-2 = drill 1.016 octagon: 1 -3.81,-1.27; 2 -3.81,1.27; 3 -1.27,-1.27; 4 -1.27,1.27; 5 1.27,-1.27; 6 1.27,1.27; 7 3.81,-1.27; 8 3.81,1.27
2X07M = drill 0.914 square: 1 -6,-1 | drill 0.914 round: 2 -6,1; 3 -4,-1; 4 -4,1; 5 -2,-1; 6 -2,1; 7 0,-1; 8 0,1; 9 2,-1; 10 2,1; 11 4,-1; 12 4,1; 13 6,-1; 14 6,1
0204/7 = drill 0.813 octagon: 1 -3.81,0; 2 3.81,0
TO92-EBC = drill 0.813 long: B 0,-1.27; C -2.54,-1.27; E 2.54,-1.27
DIL08S-SOCKET = drill 0.813 long: 1 -3.81,-3.81; 4 3.81,-3.81; 5 3.81,3.81; 8 -3.81,3.81 | drill 0.8 round: 2 -1.27,-3.81; 3 1.27,-3.81; 6 1.27,3.81; 7 -1.27,3.81

### Placement (x,y rotation side)
C1  95.57,14.92 180 bottom
C2  115.54,56.22 135 bottom
C3  113.75,58.01 315 bottom
C4  93.84,55.53 45 bottom
C5  95.54,57.22 225 bottom
C6  111.47,43.83 225 bottom
C7  113.27,45.63 45 bottom
C8  94.38,47.98 315 bottom
C9  96.18,46.18 135 bottom
C10  133.67,32.7 270 bottom
C11  139.06,7.3 180 top
C12  127.64,82.87 90 bottom
C13  137.79,86.04 180 top
C17  34.29,22.86 270 bottom
C18  58.1,22.86 270 bottom
C19  40.32,27.94 90 bottom
C20  64.14,27.94 90 bottom
C21  10.48,22.54 270 bottom
C22  16.19,28.26 90 bottom
C23  140.97,90.49 180 top
CON1  11.43,72.71 270 top
CON2  26.35,87.63 180 top
EXP  0,50.8 0 top
H1  4.45,93.34 0 top
H2  146.69,93.34 0 top
H3  146.69,5.71 0 top
H4  4.45,5.71 0 top
IC1  104.78,52.07 315 top
IC2  60.96,25.4 270 top
IC3  37.15,25.4 270 top
IC4  13.34,25.4 270 top
IC5  133.67,28.57 270 top
IC6  127.95,75.56 270 top
JP1  141.92,48.26 0 top
JP2  122.56,8.89 0 top
R14  30.16,70.17 180 top
R15  30.16,72.39 180 top
R16  30.16,74.61 180 top
R17  30.16,76.83 180 top
R18  30.16,79.06 180 top
R19  30.16,81.28 180 top
R44  130.49,50.48 270 top
TR1  135.57,40.32 180 top
U$1  SIGNATURESILK  [SIGNATURE]  96.2,88.58 0 top
XTAL1  102.23,14.92 0 top

### Tracks (layer width: path | path; a pad name or v marks a point on that pad's centre or on a via)
!CS0
  Top 0.254: IC2.5 61.91,29.84 62.55,30.48 73.66,30.48 85.09,41.91 91.44,41.91 94.93,45.4 IC1.14
!CS1  (via drill 0.61)
  Top 0.254: IC3.5 37.78,29.84 v38.1,30.16 | v39.05,37.15 57.47,55.56 62.23,55.56 65.41,58.74 91.39,58.74 IC1.136
  Bottom 0.254: v38.1,30.16 38.1,36.2 v39.05,37.15
!CS2  (via drill 0.61)
  Top 0.254: IC4.5 v13.34,29.84 | v13.34,36.2 41.59,64.45 92.08,64.45 95.89,60.64 96.56,60.64 IC1.126
  Bottom 0.254: v13.34,29.84 v13.34,36.2
!HS
  Top 0.254: CON1.13 6.74,72.95 5.08,74.61 5.08,79.69 6.67,81.28 16.19,81.28 CON2.10 20,87.63 20,91.12 21.91,93.03 93.66,93.03 102.23,84.45 102.23,66.28 IC1.110
!IO
  Top 0.254: IC1.88 114.8,60.33 120.33,60.33 122.56,58.1 135.89,58.1 136.84,57.15 EXP.C14
!IODEV1XX  (via drill 0.61)
  Top 0.254: EXP.B24 151.13,33.02 148.27,33.02 v146.37,31.11 | IC1.50 119.37,34.29 v121.6,34.29
  Bottom 0.254: v146.37,31.11 146.37,33.97 144.46,35.88 128.59,35.88 127,34.29 v121.6,34.29
!IRQ  (via drill 0.61)
  Top 0.254: JP1.6 144.46,48.26 144.46,44.13 v146.37,42.23
  Bottom 0.254: v146.37,42.23 147.96,40.64 147.96,20.95 EXP.C29
!IRQ2
  Top 0.254: JP1.8 147.32,47.94 147.32,44.45 EXP.C20
!IRQ3  (via drill 0.61)
  Top 0.254: v144.15,58.42 153.67,58.42 EXP.A13
  Bottom 0.254: JP1.2 138.11,52.39 v144.15,58.42
!IRQ4  (via drill 0.61)
  Top 0.254: EXP.A14 153.67,55.88 v144.46,55.88
  Bottom 0.254: v144.46,55.88 140.65,52.07 JP1.4
!NPR
  Top 0.254: IC4.28 20.32,29.84 20.95,30.48 24.13,30.48 24.77,29.84 27.62,29.84 28.26,29.21 38.73,29.21 39.37,29.84 IC3.28 44.13,29.84 44.77,30.48 47.62,30.48 48.26,29.84 53.66,29.84 54.29,29.21 62.55,29.21 63.18,29.84 IC2.28 74.61,29.84 86.04,41.27 91.5,41.27 IC1.15
!NPW
  Top 0.203: 50.48,20.95 IC2.12 59.05,20.95 59.69,21.59
  Top 0.254: 50.48,20.95 49.85,21.59 35.88,21.59 35.24,20.95 IC3.12 26.67,20.95 26.04,21.59 11.75,21.59 11.11,20.95 IC4.12 | IC1.25 95.25,37.95 95.25,34.92 81.92,21.59 59.69,21.59
!R
  Top 0.254: IC1.87 114.87,59.69 119.38,59.69 122.24,56.83 134.3,56.83 136.53,54.61 EXP.C15
!RESET  (via drill 0.61)
  Top 0.254: IC1.143 90.25,54.93 87.63,54.93 v87,54.29 | v77.79,25.08 78.74,25.08 v91.12,37.47 | v89.22,6.99 89.85,6.35 110.17,6.35 112.08,8.26 112.08,10.16 113.67,11.75 120.65,11.75 121.28,11.11 138.11,11.11 143.51,16.51 EXP.C30
  Bottom 0.254: v89.22,6.99 81.6,14.61 81.6,21.27 v77.79,25.08 | v91.12,37.47 87,41.59 v87,54.29
!T34
  Top 0.254: IC1.39 108.58,37.3 108.58,31.11 119.38,20.32 153.67,20.32 153.67,22.86 EXP.B27
!VS
  Top 0.254: CON1.14 7.63,75.24 6.67,76.2 6.67,78.74 7.62,79.69 20,79.69 23.81,83.5 CON2.8 22.54,87.63 22.54,89.85 23.81,91.12 92.08,91.12 100.65,82.55 100.65,66.45 IC1.112
!W
  Top 0.254: IC1.86 114.94,59.05 118.43,59.05 121.92,55.56 132.72,55.56 136.21,52.07 EXP.C16
+3V3  (via drill 0.61)
  Top 0.254: IC1.127 98.11,58.38 v98.11,57.78 | 113.26,55.96 IC1.84 | 117.78,52.7 IC1.73 | IC1.55 110.49,46.71 v110.49,47.62
  Top 0.305: IC1.8 94.81,49.53 v98.11,49.53 | IC1.42 106.73,41.27 106.36,41.27 v105.73,40.64 | 104.78,64.44 IC1.109 | IC1.141 93.25,53.34 v96.2,53.34 | IC1.1 91.92,51.59 93.19,51.59 v93.98,50.8 | v112.08,54.93 112.23,54.93 113.26,55.96 113.9,55.96 117.16,52.7 117.78,52.7 | v106.05,37.15 106.68,37.78 IC1.37
  Top 0.61: v40.32,24.77 IC3.24 | v10.48,26.04 IC4.8 | v16.19,24.77 IC4.24 | v64.14,24.77 IC2.24 | v34.29,26.04 IC3.8 | v58.1,26.04 IC2.8
  Top 0.813: v104.78,61.69 104.78,64.44 104.78,84.77 118.11,98.11 | v106.05,37.15 104.14,35.24 104.14,27.62 98.42,21.91 XTAL1.8
  Top 1.422: EXP.C4 EXP.B4 EXP.A4
  Top 1.778: XTAL1.8 96.52,18.73 87,9.21 v65.41,9.21 60.96,4.76 v28.57,4.76 11.75,4.76 v8.26,8.26 1.91,14.61 1.91,83.19 16.83,98.11 118.11,98.11 136.21,98.11 142.24,92.08 C23.+ 142.24,87.31 147,82.55 EXP.C4
  Bottom 0.305: 63.96,26.27 C20.1 | 96.6,56.28 C5.2 | JP2.2 116.47,9.89
  Bottom 0.61: 59.92,24.36 C18.1 v58.1,26.04 | 59.92,24.36 | 63.96,26.27 61.83,26.27 60.96,25.4 | 60.96,25.4 59.92,24.36 | 13.34,25.4 11.98,24.04 C21.1 v10.48,26.04 | 13.34,25.4 14.61,26.67 16.11,26.67 C22.1 v16.19,24.77 | C8.1 95.71,49.04 | C8.1 95.44,49.02 97.47,46.99 97.47,47.62 | 95.13,49.21 95.27,49.21 C8.1 | 112.8,56.83 C3.2 112.69,56.8 | 114.48,55.06 C2.1 112.8,56.83 | v110.49,47.62 111.27,47.62 C7.2 C6.1 109.98,44.89 | 34.29,24.45 C17.1 36.11,24.36 36.2,24.45 | v40.32,24.77 C19.1 40.23,26.35 38.1,26.35 37.15,25.4 | C20.1 v64.14,24.77 | 112.8,56.83 112.71,56.83 | 106.05,40.64 v105.73,40.64 | 34.29,24.45 v34.29,26.04 | 36.2,24.45 34.29,24.45 | 37.15,25.4 36.2,24.45 | v96.2,53.34 96.03,53.34 C4.1 | 98.07,15.92 98.42,16.28 XTAL1.8 | 13.34,25.4 13.34,13.34 v8.26,8.26 | 37.15,25.4 37.15,13.34 v28.57,4.76 | 60.96,25.4 60.96,13.65 v65.41,9.21 | 98.07,15.92 110.49,15.92 110.49,15.88 110.57,15.88 JP2.2 | 98.07,15.92 C1.2
  Bottom 0.813: C8.1 C9.2 98.11,48.11 v98.11,49.53 | C5.2 C4.1 94.91,54.32 93.32,52.73 arc87 93.34,51.44 v93.98,50.8 93.98,50.36 95.13,49.21 | 96.6,56.28 v98.11,57.78 102.01,61.69 v104.78,61.69 107.86,61.69 112.59,56.95 C3.2 | v105.73,40.64 109.98,44.89 | 112.71,56.83 112.08,56.2 v112.08,54.93 | v106.05,37.15 107.31,38.42 107.31,39.37 106.05,40.64
+12V
  Top 0.813: EXP.C31 EXP.B31 EXP.A31
AB0  (via drill 0.61)
  Top 0.254: IC1.98 115.25,67.85 116.75,67.85 v118.43,69.53
  Bottom 0.254: EXP.A5 153.67,78.74 124.14,78.74 118.43,73.03 v118.43,69.53
AB1  (via drill 0.61)
  Top 0.254: IC1.97 115.42,67.31 118.75,67.31 v120.33,68.9
  Bottom 0.254: EXP.A6 153.67,76.2 123.83,76.2 120.33,72.71 v120.33,68.9
AB2  (via drill 0.61)
  Top 0.254: IC1.96 115.49,66.67 120.65,66.67 v122.24,68.26
  Bottom 0.254: EXP.A7 153.67,73.66 123.51,73.66 122.24,72.39 v122.24,68.26 121.92,67.94
AB3  (via drill 0.61)
  Top 0.254: EXP.A8 153.67,71.12 v147.96,71.12 | v134.94,67.94 133.03,66.04 115.56,66.04 IC1.95
  Bottom 0.254: v147.96,71.12 138.11,71.12 v134.94,67.94
AB4  (via drill 0.61)
  Top 0.254: EXP.A9 153.67,68.58 v147.96,68.58 | v134.94,66.36 133.99,65.41 115.64,65.41 IC1.94
  Bottom 0.254: v147.96,68.58 137.16,68.58 v134.94,66.36
AB5  (via drill 0.61)
  Top 0.254: EXP.A10 153.67,66.04 v147.96,66.04 | v136.53,66.36 134.94,64.77 115.71,64.77 IC1.93
  Bottom 0.254: v136.53,66.36 137.16,66.36 137.48,66.04 v147.96,66.04
AB6  (via drill 0.61)
  Top 0.254: IC1.92 115.78,64.14 135.89,64.14 v136.53,64.77 | EXP.A11 153.67,63.5 v147.96,63.5
  Bottom 0.254: v147.96,63.5 137.79,63.5 v136.53,64.77
AB7
  Top 0.254: IC1.91 112.24,59.85 115.89,63.5 139.7,63.5 142.24,60.96 153.67,60.96 EXP.A12
B0
  Top 0.254: IC1.116 97.47,66.8 97.47,74.3 92.71,79.06 R18.1
B1
  Top 0.254: IC1.115 99.06,65.92 99.06,75.56 93.34,81.28 R19.1
BLUE
  Top 0.406: CON2.6 R19.2 R18.2 24.13,79.06 18.02,72.95 CON1.3
DB0
  Top 0.254: IC6.18 142.88,78.74 144.15,80.01 EXP.C5
DB0-3V3
  Top 0.254: IC6.2 113.67,80.01 107.63,73.98 107.63,66.59 IC1.107
DB1
  Top 0.254: IC6.17 EXP.C6
DB1-3V3
  Top 0.254: IC1.106 108.27,66.52 108.27,73.03 113.98,78.74 IC6.3
DB2
  Top 0.254: IC6.16 140.97,76.2 142.24,74.93 EXP.C7
DB2-3V3
  Top 0.254: IC6.4 114.3,77.47 108.9,72.07 108.9,66.45 IC1.105
DB3
  Top 0.254: IC6.15 139.7,74.93 142.24,72.39 EXP.C8
DB3-3V3
  Top 0.254: IC1.104 109.54,66.38 109.54,71.12 114.62,76.2 IC6.5
DB4
  Top 0.254: IC6.14 138.43,73.66 142.24,69.85 EXP.C9
DB4-3V3
  Top 0.254: IC1.103 110.17,66.31 110.17,70.17 114.94,74.93 IC6.6
DB5
  Top 0.254: IC6.13 137.16,72.39 142.24,67.31 EXP.C10
DB5-3V3
  Top 0.254: IC1.102 110.81,66.23 110.81,69.22 115.25,73.66 IC6.7
DB6
  Top 0.254: IC6.12 135.89,71.12 142.24,64.77 EXP.C11
DB6-3V3
  Top 0.254: IC1.101 111.44,66.16 111.44,68.26 115.57,72.39 IC6.8
DB7
  Top 0.254: IC6.11 134.62,69.85 142.24,62.23 EXP.C12
DB7-3V3
  Top 0.254: IC1.100 117.11,71.12 IC6.9
DB8
  Top 0.254: IC5.18 141.29,31.75 148.91,39.37 EXP.C21
DB8-3V3
  Top 0.254: IC1.49 119.94,33.02 IC5.2
DB9
  Top 0.254: IC5.17 141.6,30.48 147.96,36.83 EXP.C22
DB9-3V3
  Top 0.254: IC1.48 120.5,31.75 IC5.3
DB10
  Top 0.254: IC5.16 142.24,29.21 147.32,34.29 EXP.C23
DB10-3V3
  Top 0.254: IC1.46 120.35,30.48 IC5.4
DB11
  Top 0.254: IC5.15 146.05,27.94 EXP.C24
DB11-3V3
  Top 0.254: IC1.45 113.35,36.78 113.35,33.34 117.47,29.21 IC5.5
DB12
  Top 0.254: IC5.14 147.32,26.67 EXP.C25
DB12-3V3
  Top 0.254: IC1.44 112.39,37.02 112.39,32.7 117.16,27.94 IC5.6
DB13
  Top 0.254: IC5.13 148.59,25.4 EXP.C26
DB13-3V3
  Top 0.254: IC1.43 111.44,37.27 111.44,32.38 117.16,26.67 IC5.7
DB14
  Top 0.254: IC5.12 EXP.C27
DB14-3V3
  Top 0.254: IC1.41 110.49,36.81 110.49,31.75 116.84,25.4 IC5.8
DB15
  Top 0.254: IC5.11 148.59,22.86 EXP.C28
DB15-3V3
  Top 0.254: IC1.40 109.54,37.05 109.54,31.43 116.84,24.13 IC5.9
G0
  Top 0.254: IC1.118 94.3,68.56 94.3,71.75 91.44,74.61 R16.1
G1
  Top 0.254: IC1.117 95.89,67.68 95.89,73.03 92.08,76.83 R17.1
GND  (via drill 0.61)  (2 unrouted)
  Top 0.254: 111.48,58.42 IC1.90 | 111.87,58.1 IC1.89 | v29.84,24.77 IC3.9 | 115.79,57.78 IC1.83 IC1.82 115.25,56.54 115.25,56.52 | IC1.74 119.38,55.01 | 109.35,62.68 108.58,61.91 107.95,61.28 | IC1.144 90.21,52.7 v89.22,52.7
  Top 0.305: IC1.62 113.89,48.26 113.67,48.26 | 108.58,42.96 IC1.47 107.73,43.81 | 102.23,41.91 102.04,41.91 IC1.29 101.92,41.79 101.92,41.91 | IC1.18 98.07,45.72 98.42,45.72 | 103.45,62.23 103.5,62.23 | 111.44,58.42 111.48,58.42 | 111.76,58.1 111.87,58.1 | IC1.123 97.09,62.23 96.52,62.23 | 106.68,67.94 106.68,66.35 IC1.108 106.36,66.03 106.36,66.99 | IC1.121 100.01,60.72 100.01,60.64 | IC1.51 112.14,42.23 112.71,42.23 | IC1.64 114.67,48.9 114.62,48.9 | IC1.66 115.57,49.41 | IC1.114 102.5,63.18 102.55,63.18 | IC1.113 102.87,63.52 102.87,63.5 | IC1.125 98.53,59.37 98.74,59.37 | IC1.36 104.13,39.05 104.46,39.05 | 110.91,44.87 IC1.53 | 110.91,44.87 110.81,44.98 110.81,45.4 | 110.91,44.87 111.62,44.87 | IC1.56 112.39,45.51 112.39,46.04 | 115.25,45.4 114.62,45.4 IC1.59 IC1.60 | IC1.68 116.52,49.87 116.52,50.48 | 115.79,57.78 116.2,57.78 | IC1.111 103.5,64.3 103.5,64.14 | IC1.72 117.47,51.75 | IC1.70 IC1.69
  Top 0.406: 115.57,49.41 115.57,49.53
  Top 0.61: IC3.25 v44.45,26.04 | IC2.9 v53.66,24.77 | IC2.25 v68.26,26.04 | v5.71,24.77 IC4.9 | IC4.25 v20.95,26.04
  Bottom 1.778: 50.8,86.36 52.39,86.36
  other vias: 104.78,52.07 107.95,52.07 100.33,56.52 100.33,47.62 107.31,54.61 104.78,55.24 102.55,54.29 101.6,52.07 102.55,49.85 104.78,48.9 107.31,49.53 111.44,52.07 104.78,45.72 98.42,52.07 104.78,58.42 115.25,42.55 107,33.97 93.34,18.73 24.45,76.83 24.45,72.39 58.1,58.74 63.18,58.1 65.72,57.47 68.26,56.83 70.8,56.2 73.34,55.56 75.88,54.93 78.42,54.29 21.91,42.23 45.72,42.23 37.15,44.13 53.02,60.33 34.29,44.13 28.57,44.13 125.41,70.17 21.27,83.82 116.52,61.91 120.33,52.07 17.46,57.78 20.64,57.78 50.48,65.72 50.48,68.58 50.48,71.44 50.48,73.66 50.48,75.88 50.48,78.11 50.48,80.33 50.48,83.19 50.48,86.36 50.48,89.53 50.48,92.08 50.48,94.93 16.83,95.25 14.29,92.71 11.75,90.17 6.99,85.41 4.45,82.87 4.76,58.1 7.94,58.1 4.76,61.28 4.76,64.45 24.77,60.96 27.3,63.5 29.84,66.04 87.95,68.58 87.95,71.12 87.95,73.66 87.95,75.88 87.95,78.11 87.95,80.33 103.19,86.68 5.08,42.23 135.25,80.01 53.02,94.93 53.02,92.08 53.02,89.53 53.02,83.19 53.02,80.33 53.02,78.11 53.02,75.88 53.02,73.66 53.02,71.44 53.02,68.58 53.02,65.72 26.35,57.78 29.84,57.78 33.02,57.78 25.4,44.13 31.43,44.13 40.01,44.13 42.55,44.13 54.93,39.69 68.26,44.45 102.55,36.2 109.54,56.83 147.32,19.05 147.32,13.97 127,16.19 121.92,16.19 116.84,16.19 87.95,84.77 87.95,87 106.36,67.94 106.36,75.25 127.64,87 131.44,23.18 93.34,11.11 103.5,24.13 111.44,18.73 19.68,13.65 43.5,13.65 67.31,13.65
  pour Bottom (isolate 0.406, no thermals): 45.09,56.2 52.07,63.18 52.07,100.97 160.34,100.97 160.02,0 0,0 0,56.2
  pour Top (isolate 0.305): 104.78,66.36 90.81,52.07 104.78,38.1 118.75,52.07
  pour Top (isolate 0.406, rank 2, no thermals): 52.07,100.97 52.07,63.5 44.77,56.2 0,56.2 0,1.27 160.02,1.27 160.02,100.33
  pour Bottom (isolate 0.406, no thermals): 51.12,100.65 51.12,63.82 44.45,57.15 0,57.15 0,100.65
  pour Top (isolate 0.406, no thermals): 51.12,100.65 51.12,63.82 44.45,57.15 0,57.15 0,100.65
GREEN
  Top 0.406: CON2.4 28.89,78.11 27.62,76.83 R17.2 R16.2 24.13,74.61 20.18,70.67 CON1.2
IN/!OUT  (via drill 0.61)
  Top 0.254: IC6.1 124.78,81.28 126.05,80.01 126.05,72.71 v127,71.75 | IC1.71 119.3,49.21 125.41,49.21 v127.64,46.99 127.64,35.29 IC5.1
  Bottom 0.254: v127.64,46.99 127.64,71.12 v127,71.75
N$1
  Top 0.254: IC1.38 107.31,37.86 107.31,36.2 106.05,34.92 XTAL1.5
N$260
  Top 0.254: TR1.C JP1.1
  Bottom 0.813: JP1.7 JP1.5 JP1.3 JP1.1
N$843
  Top 0.254: R44.2 132.72,46.67 135.57,43.81 TR1.B
PA0
  Top 0.254: IC4.1 14.61,34.92 15.24,35.56 28.89,35.56 29.53,34.92 IC3.1 32.38,34.92 33.02,35.56 52.7,35.56 53.34,34.92 IC2.1 56.83,34.92 57.47,35.56 66.04,35.56 78.11,47.62 90.78,47.62 IC1.5
PA1
  Top 0.254: IC4.2 15.24,33.66 15.88,34.29 27.62,34.29 28.26,33.66 IC3.2 33.66,33.66 34.29,34.29 51.44,34.29 52.07,33.66 IC2.2 58.1,33.66 58.74,34.29 67.94,34.29 80.01,46.35 90.93,46.35 IC1.7
PA2
  Top 0.254: IC4.3 16.51,32.38 17.14,33.02 26.35,33.02 26.99,32.38 IC3.3 34.92,32.38 35.56,33.02 50.16,33.02 50.8,32.38 IC2.3 59.37,32.38 60.01,33.02 69.85,33.02 81.28,44.45 91.14,44.45 IC1.10
PA3
  Top 0.254: IC4.4 17.14,31.11 17.78,31.75 25.08,31.75 25.72,31.11 IC3.4 36.2,31.11 36.83,31.75 48.9,31.75 49.53,31.11 IC2.4 60.64,31.11 61.28,31.75 71.75,31.75 83.19,43.18 91.29,43.18 IC1.12
PA4
  Top 0.203: 49.21,19.68 IC2.13 | 60.33,19.68 60.96,20.32
  Top 0.254: 49.21,19.68 48.58,20.32 37.15,20.32 36.51,19.68 IC3.13 25.4,19.68 24.77,20.32 13.02,20.32 12.38,19.68 IC4.13 | IC2.13 60.33,19.68 | IC1.27 96.52,37.8 96.52,33.66 83.19,20.32 60.96,20.32
PA5
  Top 0.203: 47.94,18.41 IC2.14 61.59,18.41 62.23,19.05
  Top 0.254: 47.94,18.41 47.31,19.05 38.42,19.05 37.78,18.41 IC3.14 24.13,18.41 23.5,19.05 14.29,19.05 13.65,18.41 IC4.14 | IC1.30 97.79,36.95 97.79,32.38 84.45,19.05 62.23,19.05
PA6
  Top 0.203: 46.67,17.14 IC2.15 62.87,17.14 63.5,17.78
  Top 0.254: 46.67,17.14 46.04,17.78 39.69,17.78 39.05,17.14 IC3.15 22.86,17.14 22.23,17.78 15.56,17.78 14.92,17.14 IC4.15 | IC1.32 99.06,36.81 99.06,31.11 85.72,17.78 63.5,17.78
PA7
  Top 0.203: 45.4,15.88 IC2.16 64.14,15.88 64.77,16.51
  Top 0.254: 45.4,15.88 44.77,16.51 40.96,16.51 40.32,15.88 IC3.16 21.59,15.88 20.95,16.51 16.83,16.51 16.19,15.88 IC4.16 | IC1.34 100.33,36.66 100.33,29.84 87,16.51 64.77,16.51
PA8
  Top 0.203: 44.77,15.24 64.77,15.24
  Top 0.254: 44.77,15.24 44.13,15.88 IC3.17 41.59,15.88 40.96,15.24 20.95,15.24 20.32,15.88 IC4.17 | 64.77,15.24 65.41,15.88 IC2.17 87.63,15.88 100.97,29.21 100.97,36.59 IC1.35
PA9
  Top 0.203: 46.04,16.51 63.5,16.51 64.14,17.14
  Top 0.254: 46.04,16.51 45.4,17.14 IC3.18 40.32,17.14 39.69,16.51 22.23,16.51 21.59,17.14 IC4.18 | 64.14,17.14 IC2.18 86.36,17.14 99.69,30.48 99.69,36.74 IC1.33
PA10
  Top 0.203: 47.31,17.78 62.23,17.78 62.87,18.41
  Top 0.254: 47.31,17.78 46.67,18.41 IC3.19 39.05,18.41 38.42,17.78 23.5,17.78 22.86,18.41 IC4.19 | 62.87,18.41 IC2.19 85.09,18.41 98.42,31.75 98.42,36.88 IC1.31
PA11
  Top 0.203: 48.58,19.05 60.96,19.05 61.59,19.68
  Top 0.254: 48.58,19.05 47.94,19.68 IC3.20 37.78,19.68 37.15,19.05 24.77,19.05 24.13,19.68 IC4.20 | 61.59,19.68 IC2.20 83.82,19.68 97.16,33.02 97.16,37.73 IC1.28
PA12
  Top 0.203: 49.85,20.32 59.69,20.32 60.33,20.95
  Top 0.254: 49.85,20.32 49.21,20.95 IC3.21 36.51,20.95 35.88,20.32 26.04,20.32 25.4,20.95 IC4.21 | 60.33,20.95 IC2.21 82.55,20.95 95.89,34.29 95.89,37.88 IC1.26
PA13
  Top 0.254: IC4.29 24.45,31.11 25.08,30.48 36.83,30.48 37.47,31.11 IC3.29 48.26,31.11 48.9,30.48 61.28,30.48 61.91,31.11 IC2.29 72.71,31.11 84.14,42.55 91.36,42.55 IC1.13
PA14
  Top 0.254: IC4.30 25.72,32.38 26.35,31.75 35.56,31.75 36.2,32.38 IC3.30 49.53,32.38 50.16,31.75 60.01,31.75 60.64,32.38 IC2.30 70.8,32.38 82.23,43.81 91.22,43.81 IC1.11
PA15
  Top 0.254: IC4.31 26.99,33.66 27.62,33.02 34.29,33.02 34.92,33.66 IC3.31 50.8,33.66 51.44,33.02 58.74,33.02 59.37,33.66 IC2.31 68.9,33.66 80.38,45.13 91.12,45.13 IC1.9
PA16
  Top 0.254: IC4.32 28.26,34.92 28.89,34.29 33.02,34.29 33.66,34.92 IC3.32 52.07,34.92 52.7,34.29 57.47,34.29 58.1,34.92 IC2.32 66.99,34.92 79.06,46.99 90.86,46.99 IC1.6
PD0
  Top 0.254: IC2.6 63.18,28.57 63.82,29.21 75.56,29.21 87,40.64 91.58,40.64 IC1.16
PD1
  Top 0.254: IC2.7 64.45,27.3 65.09,27.94 77.47,27.94 88.58,39.05 92.11,39.05 IC1.19
PD2
  Top 0.254: IC2.10 64.77,23.5 65.41,24.13 79.38,24.13 92.71,37.47 92.71,38.24 IC1.21
PD3
  Top 0.254: IC2.11 57.78,22.23 58.42,22.86 80.64,22.86 93.98,36.2 93.98,38.09 IC1.23 96.84,40.96
PD4
  Top 0.254: IC1.24 94.61,38.02 94.61,35.56 81.28,22.23 IC2.22
PD5
  Top 0.254: IC1.22 93.34,38.16 93.34,36.83 80.01,23.5 IC2.23
PD6
  Top 0.254: IC1.20 92.18,38.42 89.53,38.42 78.42,27.3 IC2.26
PD7
  Top 0.254: IC1.17 91.65,40.01 87.95,40.01 76.52,28.57 IC2.27
PD8  (via drill 0.61)
  Top 0.254: IC3.6 40.96,28.57 41.59,29.21 46.04,29.21 v46.35,29.53 | IC1.137 91.32,58.1 67.94,58.1 63.5,53.66 58.1,53.66 48.9,44.45 48.26,44.45 v46.99,43.18
  Bottom 0.254: v46.35,29.53 47.94,31.11 47.94,38.73 47.31,39.37 47.31,41.27 46.99,41.59 v46.99,43.18
PD9  (via drill 0.61)
  Top 0.254: IC3.7 40.96,27.3 41.59,27.94 46.04,27.94 46.67,27.3 v48.58,27.3 | IC1.139 91.17,56.83 73.03,56.83 66.04,49.85 58.74,49.85 51.44,42.55 50.16,42.55 v48.9,41.27
  Bottom 0.254: v48.58,27.3 49.21,27.94 49.21,39.37 48.9,39.69 v48.9,41.27
PD10  (via drill 0.61)
  Top 0.254: IC3.10 40.96,23.5 41.59,24.13 49.21,24.13 v49.85,24.77 | IC1.142 90.32,55.56 78.11,55.56 68.58,46.04 59.37,46.04 53.98,40.64 52.07,40.64 v50.8,39.37
  Bottom 0.254: v49.85,24.77 50.48,25.4 50.48,39.05 v50.8,39.37
PD11  (via drill 0.61)
  Top 0.254: IC3.11 33.97,22.23 34.61,22.86 51.75,22.86 v52.07,23.18 | IC1.3 90.64,48.9 76.2,48.9 64.77,37.47 v52.7,37.47
  Bottom 0.254: v52.7,37.47 51.75,36.51 51.75,25.08 52.07,24.77 v52.07,23.18
PD12  (via drill 0.61)
  Top 0.254: IC3.22 v53.02,22.23 | IC1.4 90.71,48.26 77.15,48.26 65.41,36.51 v53.66,36.51
  Bottom 0.254: v53.66,36.51 52.39,35.24 52.39,25.4 52.7,25.08 52.7,24.13 53.02,23.81 v53.02,22.23
PD13  (via drill 0.61)
  Top 0.254: IC3.23 50.48,23.5 v51.12,24.13 | IC1.2 90.57,49.53 75.25,49.53 64.14,38.42 v51.75,38.42
  Bottom 0.254: v51.12,24.13 51.12,37.78 v51.75,38.42
PD14  (via drill 0.61)
  Top 0.254: IC3.26 45.4,27.3 v46.67,26.04 | IC1.140 91.1,56.2 75.56,56.2 67.31,47.94 59.05,47.94 52.7,41.59 51.12,41.59 v49.85,40.32
  Bottom 0.254: v46.67,26.04 49.21,26.04 49.85,26.67 v49.85,40.32
PD15  (via drill 0.61)
  Top 0.254: IC3.27 47.62,28.57 v47.94,28.89 | IC1.138 91.25,57.47 70.48,57.47 64.77,51.75 58.42,51.75 50.16,43.5 49.21,43.5 v47.94,42.23
  Bottom 0.254: v47.94,28.89 48.58,29.53 48.58,39.05 47.94,39.69 v47.94,42.23
PD16  (via drill 0.61)
  Top 0.254: IC4.6 17.14,28.57 17.78,29.21 22.86,29.21 v23.18,29.53 | IC1.128 91.97,63.82 43.81,63.82 v23.18,43.18
  Bottom 0.254: v23.18,29.53 v23.18,43.18
PD17  (via drill 0.61)
  Top 0.254: IC4.7 17.14,27.3 17.78,27.94 23.18,27.94 v23.81,27.3 | IC1.130 91.82,62.55 48.26,62.55 26.99,41.27 v25.08,41.27
  Bottom 0.254: v25.08,41.27 25.08,30.16 26.04,29.21 26.04,27.94 25.4,27.3 v23.81,27.3
PD18  (via drill 0.61)
  Top 0.254: IC4.10 17.14,23.5 17.78,24.13 25.08,24.13 v25.72,24.77 | v26.99,39.37 30.8,39.37 52.7,61.28 91.68,61.28 IC1.132
  Bottom 0.254: v25.72,24.77 26.99,26.04 26.99,26.35 27.94,27.3 27.94,30.48 26.99,31.43 v26.99,39.37
PD19  (via drill 0.61)
  Top 0.254: IC4.11 10.16,22.23 10.79,22.86 27.62,22.86 v27.94,23.18 | IC1.134 91.53,60.01 57.15,60.01 34.61,37.47 v28.89,37.47
  Bottom 0.254: v27.94,23.18 28.26,23.5 28.26,25.72 29.21,26.67 29.21,32.38 28.89,32.7 v28.89,37.47
PD20  (via drill 0.61)
  Top 0.254: IC4.22 v28.89,22.23 | IC1.135 91.46,59.37 62.87,59.37 60.96,57.47 57.15,57.47 36.2,36.51 v29.84,36.51
  Bottom 0.254: v28.89,22.23 28.89,25.4 29.84,26.35 v29.84,36.51
PD21  (via drill 0.61)
  Top 0.254: IC4.23 26.35,23.5 v26.99,24.13 | IC1.133 91.61,60.64 54.93,60.64 32.7,38.42 v27.94,38.42
  Bottom 0.254: v26.99,24.13 27.62,24.77 27.62,26.04 28.57,26.99 28.57,31.43 27.94,32.07 v27.94,38.42
PD22  (via drill 0.61)
  Top 0.254: IC4.26 21.91,27.3 v23.18,26.04 | v26.04,40.32 28.89,40.32 50.48,61.91 91.75,61.91 IC1.131
  Bottom 0.254: v23.18,26.04 25.4,26.04 26.99,27.62 26.99,29.84 26.04,30.8 v26.04,40.32
PD23  (via drill 0.61)
  Top 0.254: IC4.27 v24.77,28.57 | IC1.129 91.89,63.18 46.04,63.18 25.08,42.23 v24.13,42.23
  Bottom 0.254: v24.13,42.23 24.13,29.21 v24.77,28.57
R0
  Top 0.254: IC1.120 92.23,69.22 91.12,69.22 90.17,70.17 R14.1
R1
  Top 0.254: IC1.119 92.39,69.76 92.39,70.8 90.81,72.39 R15.1
RED
  Top 0.406: CON2.2 31.43,76.2 27.62,72.39 R15.2 R14.2 24.13,70.17 22.34,68.38 CON1.1
TCK  (via drill 0.61)
  Top 0.254: IC1.67 120.33,45.35 v120.33,41.91
  Bottom 0.254: JP2.6 120.56,11.21 120.33,11.43 v120.33,41.91
TDI  (via drill 0.61)
  Top 0.254: IC1.63 118.43,44.43 v118.43,41.91 | v123.51,19.37 119.06,19.37 117.79,20.64 v116.84,20.64
  Bottom 0.254: v116.84,20.64 118.43,22.23 v118.43,41.91 | v123.51,19.37 124.56,18.32 JP2.10
TDO  (via drill 0.61)
  Top 0.254: IC1.122 98.11,61.91 98.11,62.55 93.66,66.99 32.7,66.99 4.76,39.05 4.76,15.24 12.7,7.3 60.01,7.3 64.14,11.43 85.41,11.43 v86.68,12.7 | v90.81,8.57 91.44,7.94 109.54,7.94 110.49,8.89 110.49,10.79 113.03,13.34 v121.6,13.34
  Bottom 0.254: v121.6,13.34 122.56,12.38 JP2.8 | v86.68,12.7 v90.81,8.57
TMS  (via drill 0.61)
  Top 0.254: IC1.65 119.38,44.89 v119.38,40.32
  Bottom 0.254: JP2.4 118.56,11.11 119.38,11.94 v119.38,40.32
VCC  (via drill 0.61)  (1 unrouted)
  Top 0.61: v130.18,81.28 IC6.20 v138.11,81.28 139.06,82.23 C13.+ | IC5.20 v135.89,34.29 v135.89,22.86 | 144.15,11.11 v142.56,12.7
  Top 0.813: EXP.C3 EXP.B3 EXP.A3 | EXP.C32 144.46,11.43 144.15,11.11 C11.+
  Top 1.27: EXP.C32 EXP.B32 EXP.A32
  Bottom 0.61: v135.89,34.29 133.75,34.29 C10.1 | v130.18,81.28 127.72,81.28 C12.1 | v138.11,81.28 141.92,85.09 EXP.C3 | v135.89,22.86 135.89,19.37 v142.56,12.7
VDUINT
  Top 0.254: IC1.85 115.01,58.42 117.47,58.42 121.6,54.29 R44.1

### Text on the board
tNames: !VS | !HS | B | G | R | (c) 2012 AlexiosC | Video out | VGA | 640x400 75 Hz | http://www.bedroomlan.org/cft | IRQ3 | IRQ4 | IRQ | IRQ2 | CFT Minicomputer Video Board rev D